# EAGLE design iridia-tam-main-board (EAGLE 6.4)

## Sheet 1 of 5
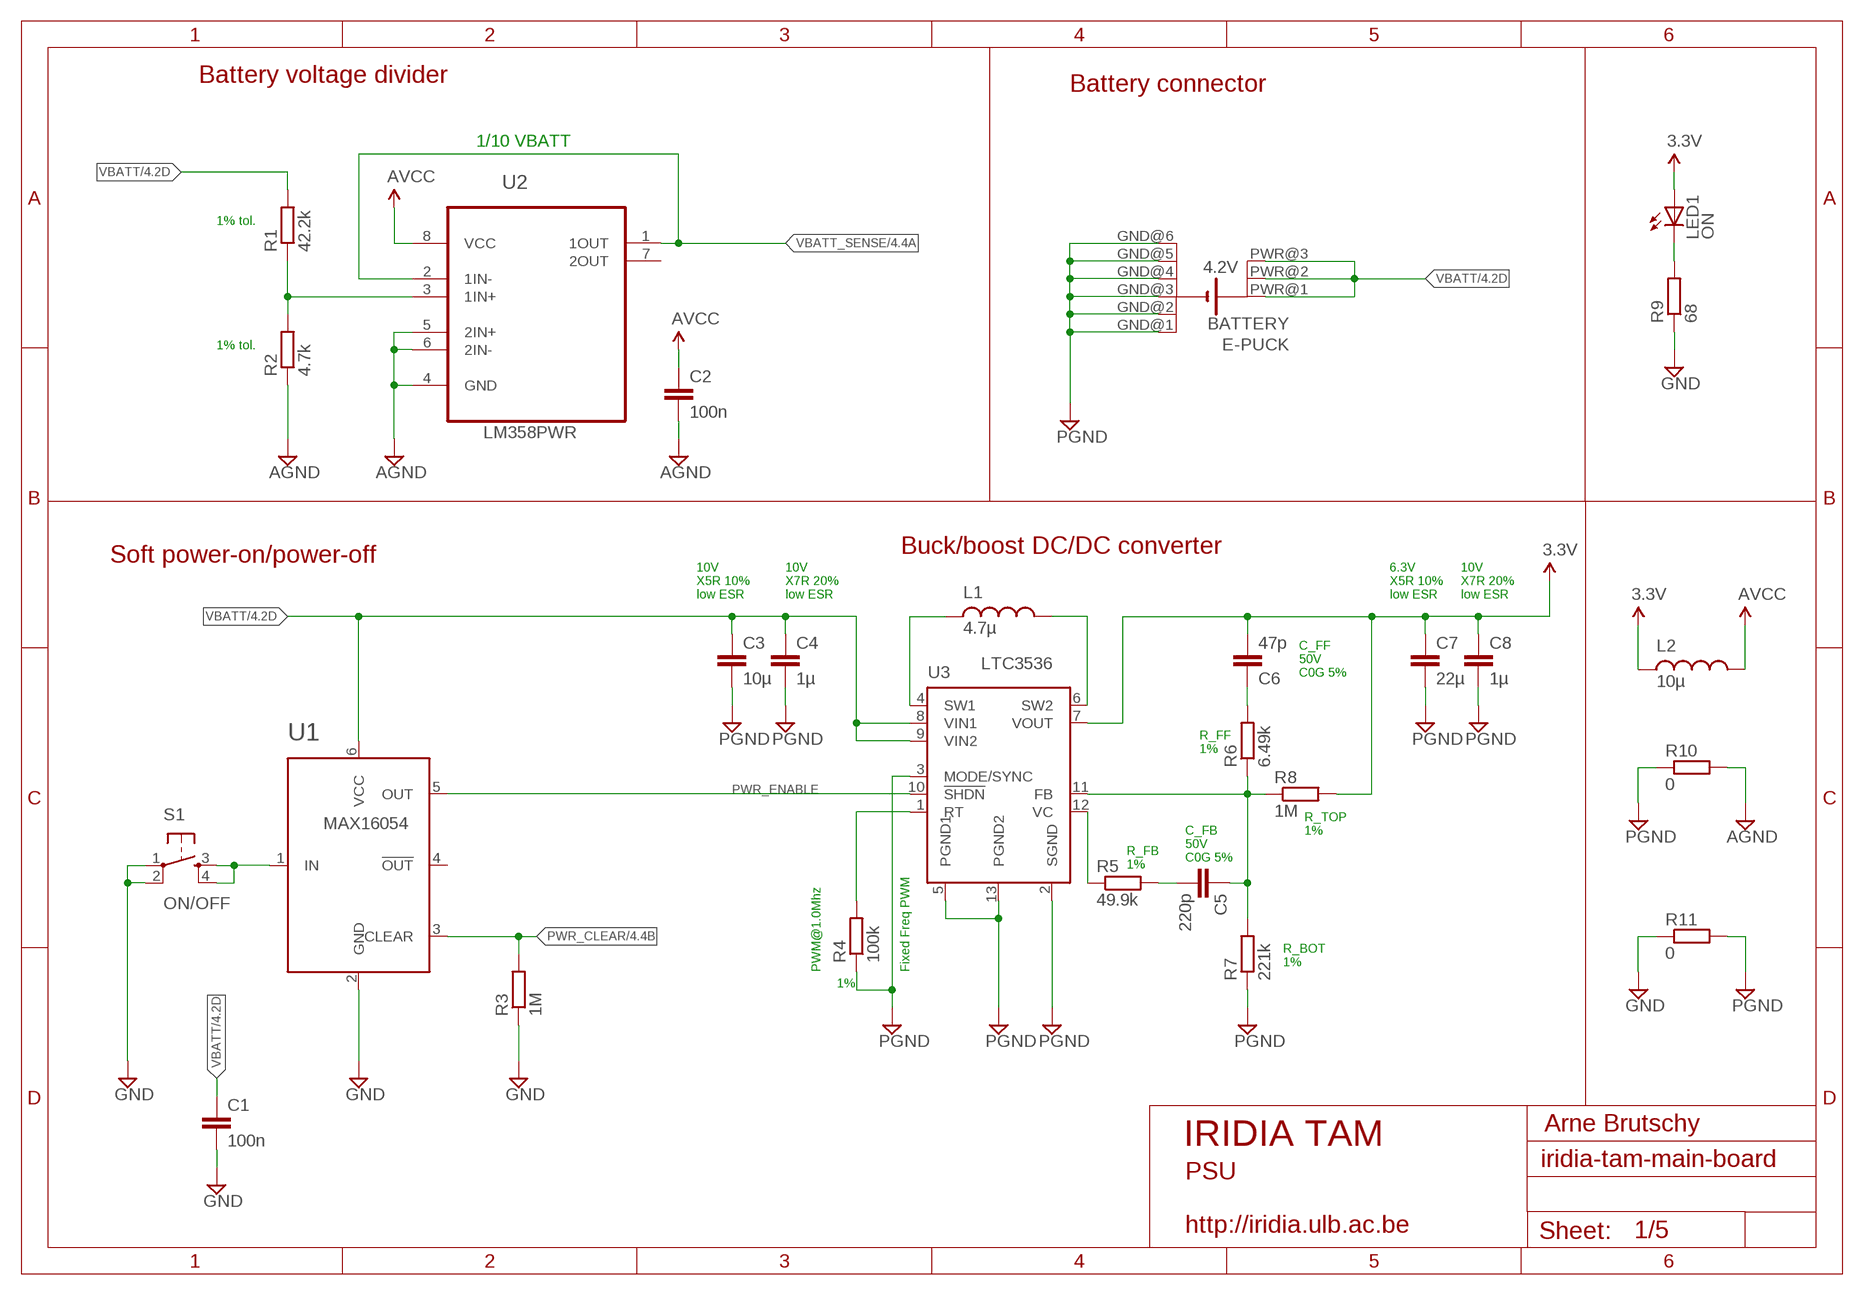
[diagram p0: schematic, sheet 1]

### Parts
C1  100n  C-EUC0603  [C0603]
C2  100n  C-EUC0603  [C0603]
C3  10µ  C-EUC0805  [C0805]
C4  1µ  C-EUC0603  [C0603]
C5  220p  C-EUC0603  [C0603]
C6  47p  C-EUC0603  [C0603]
C7  22µ  C-EUC1206  [C1206]
C8  1µ  C-EUC0603  [C0603]
JP1  EPUCK_BATTERY  [EPUCK_BATTERY]
L1  4.7µ  TDK-INDUCTORS-VLCF  [TDK-VLCF]
L2  10µ  0805-INDUCTORS  [L0805]
LED1  ON  LEDCHIPLED_1206  [CHIPLED_1206]
R1  42.2k  R-EU_R0603  [R0603]
R2  4.7k  R-EU_R0603  [R0603]
R3  1M  R-EU_R0603  [R0603]
R4  100k  R-EU_R0603  [R0603]
R5  49.9k  R-EU_R0603  [R0603]
R6  6.49k  R-EU_R0603  [R0603]
R7  221k  R-EU_R0603  [R0603]
R8  1M  R-EU_R0603  [R0603]
R9  68  R-EU_R0603  [R0603]
R10  0  R-EU_R0603  [R0603]
R11  0  R-EU_R0603  [R0603]
S1  ON/OFF  TAC_SWITCHSMD  [TACTILE_SWITCH_SMD]
U1  MAX16054  [SOT23-6-INV]
U2  LM358PW  [SOP65P640X120-8N]
U3  LTC3536  [MSOP12-EP]

### Nets
AGND [gnd]: C2.2 R2.1 R10.2 U2.4(GND) U2.5(2IN+) U2.6(2IN-) ; also sheet 2,4,5
AVCC [power]: C2.1 L2.2 U2.8(VCC) ; also sheet 2,4,5
GND [gnd]: C1.2 R3.1 R9.1 R11.1 S1.1 S1.2 U1.2(GND) ; also sheet 2,3,4,5
N$4: C6.1 R6.2
N$6 [power]: R4.2 U3.1(RT)
N$11: R1.1 R2.2 U2.3(1IN+)
N$12: LED1.C R9.2
N$15: L1.P$1 U3.4(SW1)
N$16: L1.P$2 U3.6(SW2)
N$18: S1.3 S1.4 U1.1(IN)
N$19: R5.1 U3.12(VC)
N$21: C5.1 R6.1 R7.2 R8.1 U3.11(FB)
N$22: C5.2 R5.2
PGND [gnd]: C3.2 C4.2 C7.2 C8.2 JP1.GND@1(-1) JP1.GND@2(-2) JP1.GND@3(-3) JP1.GND@4(-4) JP1.GND@5(-5) JP1.GND@6(-6) R4.1 R7.1 R10.1 R11.2 U3.2(SGND) U3.3(MODE/SYNC) U3.5(PGND1) U3.13(PGND2) ; also sheet 5
PWR_CLEAR: R3.2 U1.3(CLEAR) ; also sheet 4
PWR_ENABLE: U1.5(OUT) U3.10(!SHDN)
VBATT [power]: C1.1 C3.1 C4.1 JP1.PWR@1(+1) JP1.PWR@2(+2) JP1.PWR@3(+3) R1.2 U1.6(VCC) U3.8(VIN1) U3.9(VIN2) ; also sheet 4,5
VBATT_SENSE: U2.1(1OUT) U2.2(1IN-) ; also sheet 4
VCC [power]: C6.2 C7.1 C8.1 L2.1 LED1.A R8.2 U3.7(VOUT) ; supply symbol labelled 3.3V ; also sheet 2,3,4,5
Unconnected: U1.4(!OUT) U2.7(2OUT)

### Notes on the sheet
- Battery voltage divider
- Battery connector
- 1/10 VBATT
- 1% tol.
- 1% tol.
- LM358PWR
- Buck/boost DC/DC converter
- Soft power-on/power-off
- 10V
  X5R 10%
  low ESR
- 10V
  X7R 20%
  low ESR
- 6.3V
  X5R 10%
  low ESR
- 10V
  X7R 20%
  low ESR
- LTC3536
- C_FF
  50V
  C0G 5%
- U1
- R_FF
  1%
- R_TOP
  1%
- C_FB
  50V
  C0G 5%
- R_FB
  1%
- R_BOT
  1%
- PWM@1.0Mhz | Fixed Freq PWM
- 1%
- Arne Brutschy
- IRIDIA TAM
- PSU
- http://iridia.ulb.ac.be

## Sheet 2 of 5
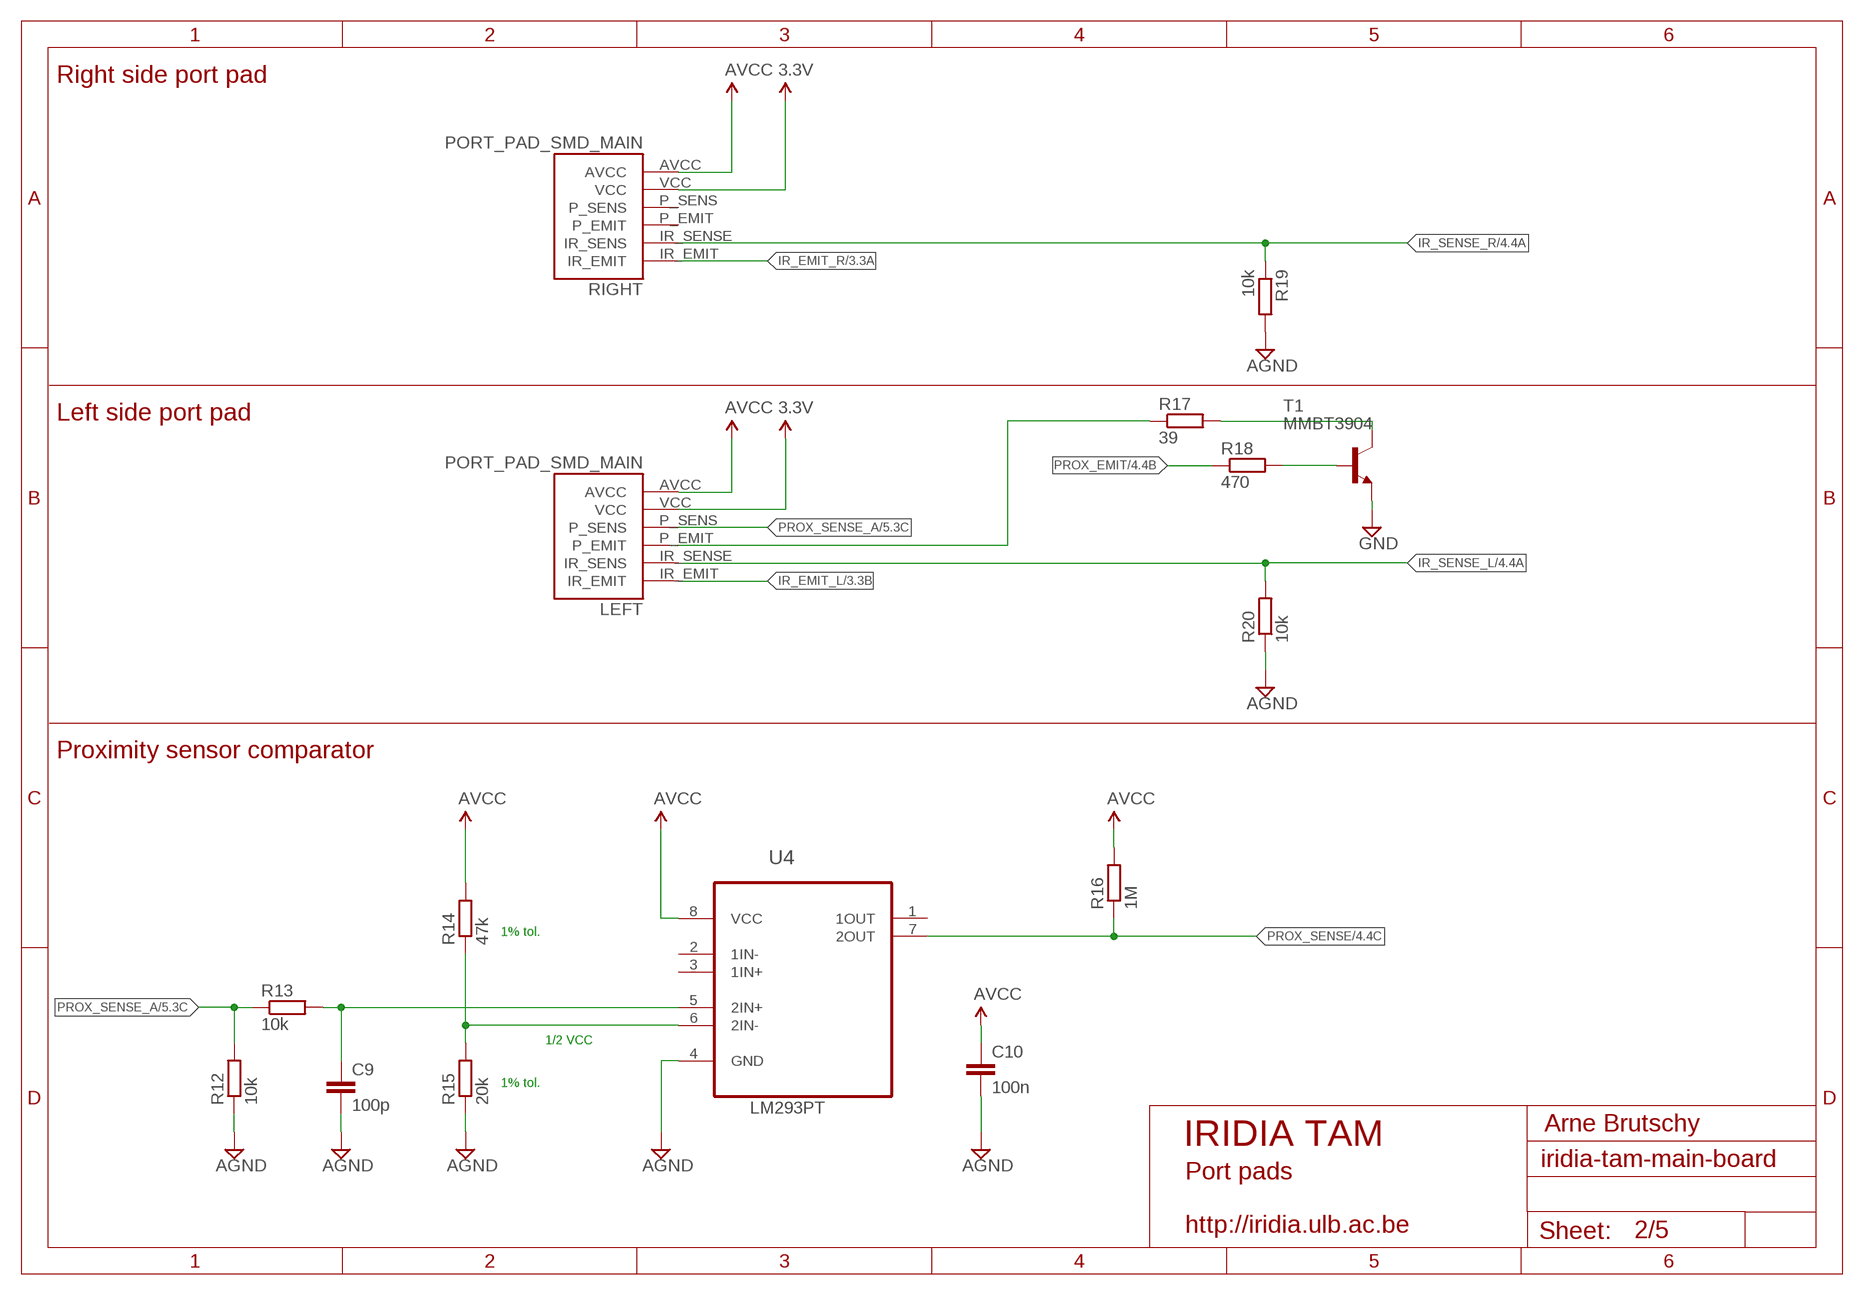
[diagram p1: schematic, sheet 2]

### Parts
C9  100p  C-EUC0603  [C0603]
C10  100n  C-EUC0603  [C0603]
LEFT  PORT_PAD_SMD_MAIN  [PORT_PAD_SMD_MAIN]
R12  10k  R-EU_R0603  [R0603]
R13  10k  R-EU_R0603  [R0603]
R14  47k  R-EU_R0603  [R0603]
R15  20k  R-EU_R0603  [R0603]
R16  1M  R-EU_R0603  [R0603]
R17  39  R-EU_R0603  [R0603]
R18  470  R-EU_R0603  [R0603]
R19  10k  R-EU_R0603  [R0603]
R20  10k  R-EU_R0603  [R0603]
RIGHT  PORT_PAD_SMD_MAIN  [PORT_PAD_SMD_MAIN]
T1  MMBT3904  MMBT3904LT1-NPN-SOT23-BEC  [SOT23-BEC]
U4  LM293PT  [8-TSSOP_4.4MM]

### Nets
AGND [gnd]: C9.2 C10.2 R12.1 R15.1 R19.2 R20.1 U4.4(GND) ; also sheet 1,4,5
AVCC [power]: C10.1 LEFT.AVCC R14.2 R16.2 RIGHT.AVCC U4.8(VCC) ; also sheet 1,4,5
GND [gnd]: T1.E ; also sheet 1,3,4,5
IR_EMIT_L: LEFT.IR_EMIT ; also sheet 3
IR_EMIT_R: RIGHT.IR_EMIT ; also sheet 3
IR_SENSE_L: LEFT.IR_SENSE(IR_SENS) R20.2 ; also sheet 4
IR_SENSE_R: R19.1 RIGHT.IR_SENSE(IR_SENS) ; also sheet 4
N$2: LEFT.P_EMIT R17.1
N$9: R14.1 R15.2 U4.6(2IN-)
N$14: R18.2 T1.B
N$20: R17.2 T1.C
PROX_EMIT: R18.1 ; also sheet 4
PROX_SENSE: R16.1 U4.7(2OUT) ; also sheet 4,5
PROX_SENSE_A: LEFT.P_SENS R12.2 R13.1 ; also sheet 5
PROX_SENSE_S: C9.1 R13.2 U4.5(2IN+) ; also sheet 5
VCC [power]: LEFT.VCC RIGHT.VCC ; supply symbol labelled 3.3V ; also sheet 1,3,4,5
Unconnected: RIGHT.P_EMIT RIGHT.P_SENS U4.1(1OUT) U4.2(1IN-) U4.3(1IN+)

### Notes on the sheet
- Right side port pad
- Left side port pad
- Proximity sensor comparator
- 1% tol.
- 1/2 VCC
- 1% tol.
- LM293PT
- Arne Brutschy
- IRIDIA TAM
- Port pads
- http://iridia.ulb.ac.be

## Sheet 3 of 5
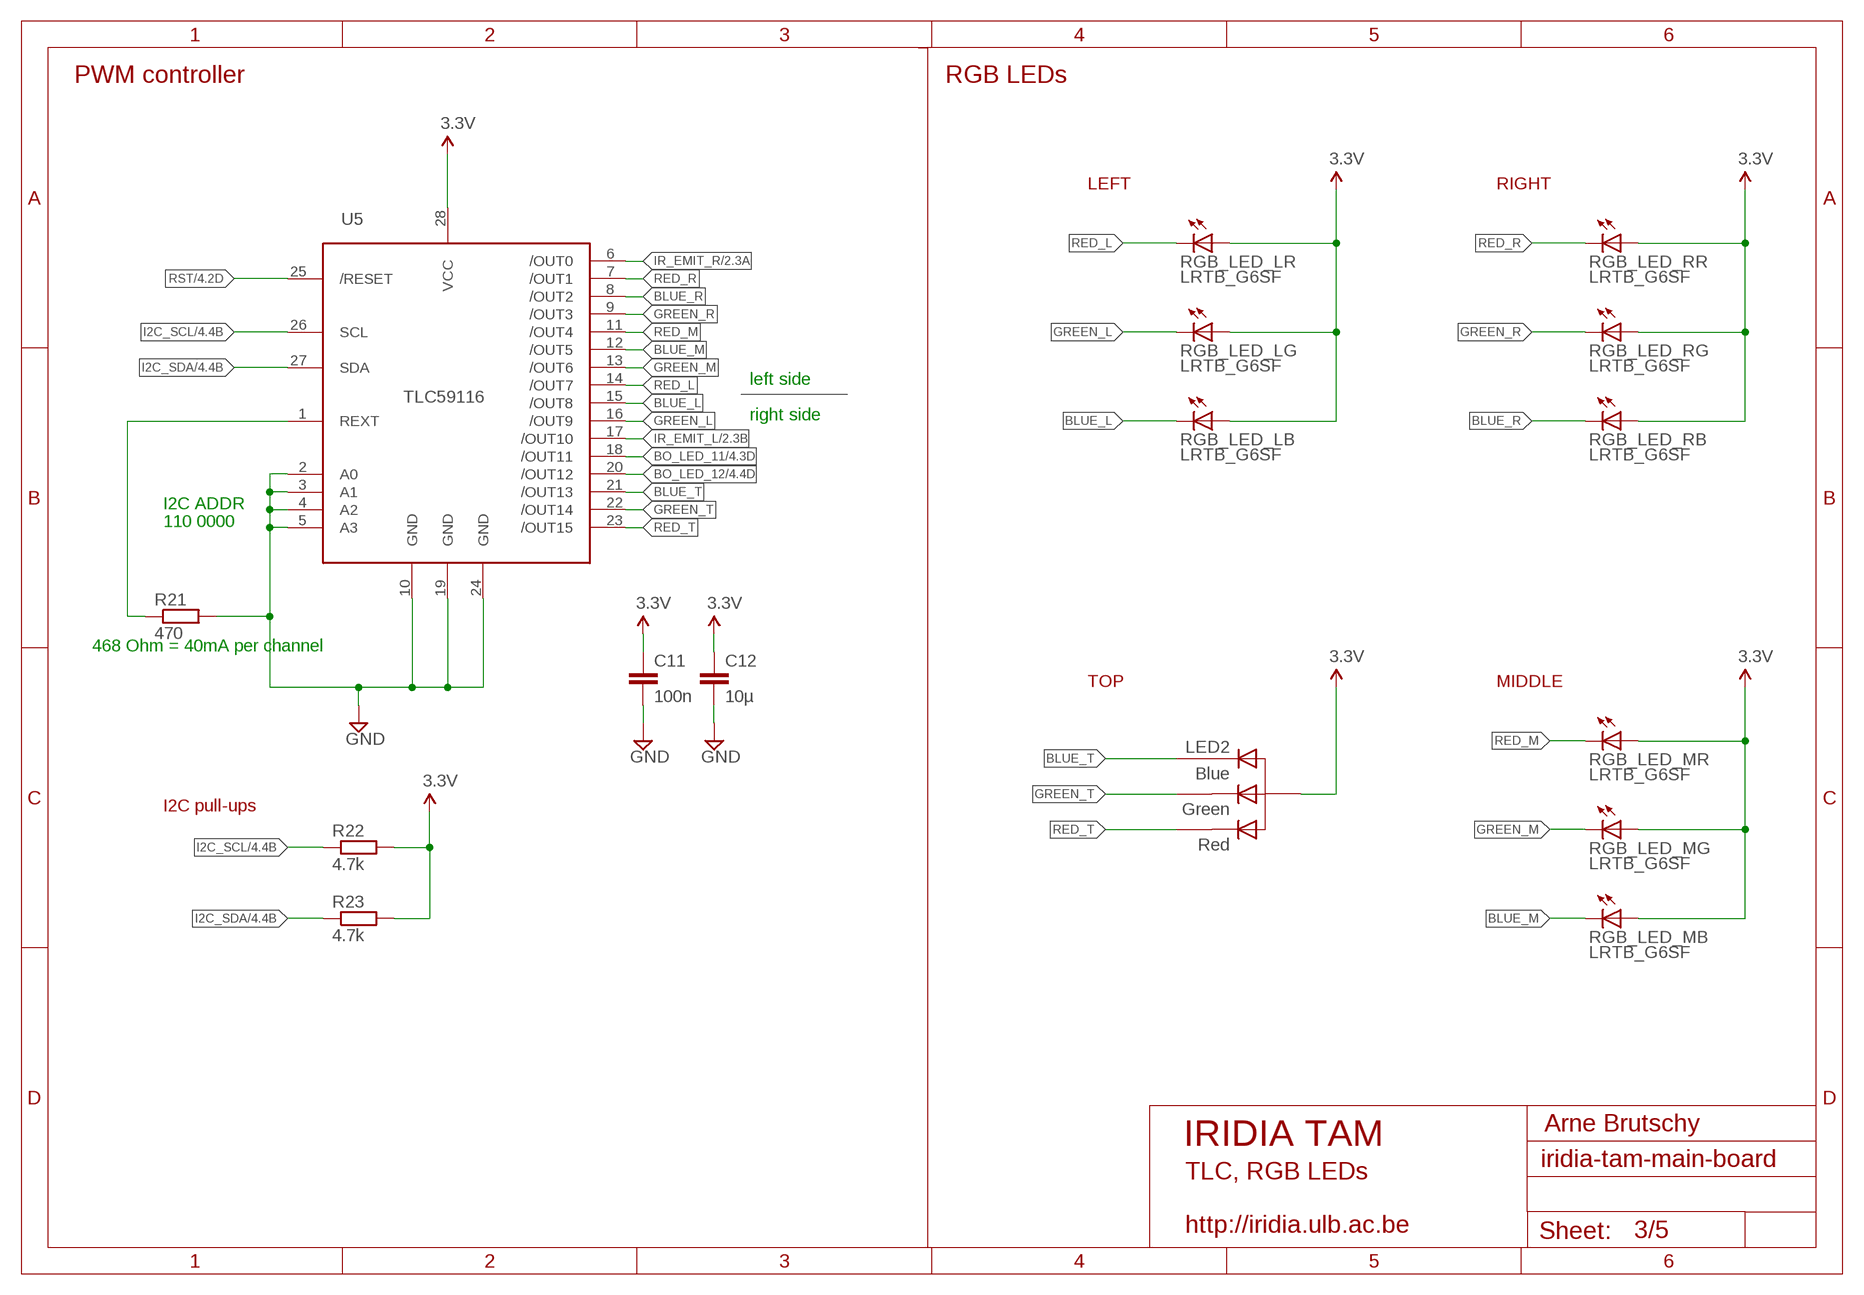
[diagram p2: schematic, sheet 3]

### Parts
C11  100n  C-EUC0603  [C0603]
C12  10µ  C-EUC0805  [C0805]
LED2  RGBLED_CA5MMTROUGHHOLE  [LED5MMRGB]
R21  470  R-EU_R0603  [R0603]
R22  4.7k  R-EU_R0603  [R0603]
R23  4.7k  R-EU_R0603  [R0603]
RGB_LED_L  LRTB_G6SF  MULTILED_LRTB_G6TG  [P-LCC-6_TOPLED]
RGB_LED_M  LRTB_G6SF  MULTILED_LRTB_G6TG  [P-LCC-6_TOPLED]
RGB_LED_R  LRTB_G6SF  MULTILED_LRTB_G6TG  [P-LCC-6_TOPLED]
U5  TLC59116-TSSOP  [TSSOP28]

### Nets
BLUE_L: RGB_LED_L.C3(B:C) U5.15(/OUT8)
BLUE_M: RGB_LED_M.C3(B:C) U5.12(/OUT5)
BLUE_R: RGB_LED_R.C3(B:C) U5.8(/OUT2)
BLUE_T: LED2.4(CB) U5.21(/OUT13)
BO_LED_11: U5.18(/OUT11) ; also sheet 4
BO_LED_12: U5.20(/OUT12) ; also sheet 4
GND [gnd]: C11.2 C12.2 R21.2 U5.2(A0) U5.3(A1) U5.4(A2) U5.5(A3) U5.10(GND) U5.19(GND) U5.24(GND) ; also sheet 1,2,4,5
GREEN_L: RGB_LED_L.C2(G:C) U5.16(/OUT9)
GREEN_M: RGB_LED_M.C2(G:C) U5.13(/OUT6)
GREEN_R: RGB_LED_R.C2(G:C) U5.9(/OUT3)
GREEN_T: LED2.3(CG) U5.22(/OUT14)
I2C_SCL: R22.1 U5.26(SCL) ; also sheet 4
I2C_SDA: R23.1 U5.27(SDA) ; also sheet 4
IR_EMIT_L: U5.17(/OUT10) ; also sheet 2
IR_EMIT_R: U5.6(/OUT0) ; also sheet 2
RED_L: RGB_LED_L.C1(R:C) U5.14(/OUT7)
RED_M: RGB_LED_M.C1(R:C) U5.11(/OUT4)
RED_R: RGB_LED_R.C1(R:C) U5.7(/OUT1)
RED_T: LED2.1(CR) U5.23(/OUT15)
REXT: R21.1 U5.1(REXT)
RST: U5.25(/RESET) ; also sheet 4
VCC [power]: C11.1 C12.1 LED2.2(A) R22.2 R23.2 RGB_LED_L.A1(R:A) RGB_LED_L.A2(G:A) RGB_LED_L.A3(B:A) RGB_LED_M.A1(R:A) RGB_LED_M.A2(G:A) RGB_LED_M.A3(B:A) RGB_LED_R.A1(R:A) RGB_LED_R.A2(G:A) RGB_LED_R.A3(B:A) U5.28(VCC) ; supply symbol labelled 3.3V ; also sheet 1,2,4,5

### Notes on the sheet
- PWM controller | RGB LEDs
- LEFT | RIGHT
- left side
- right side
- I2C ADDR
- 110 0000
- 468 Ohm = 40mA per channel
- TOP | MIDDLE
- I2C pull-ups
- Arne Brutschy
- IRIDIA TAM
- TLC, RGB LEDs
- http://iridia.ulb.ac.be

## Sheet 4 of 5
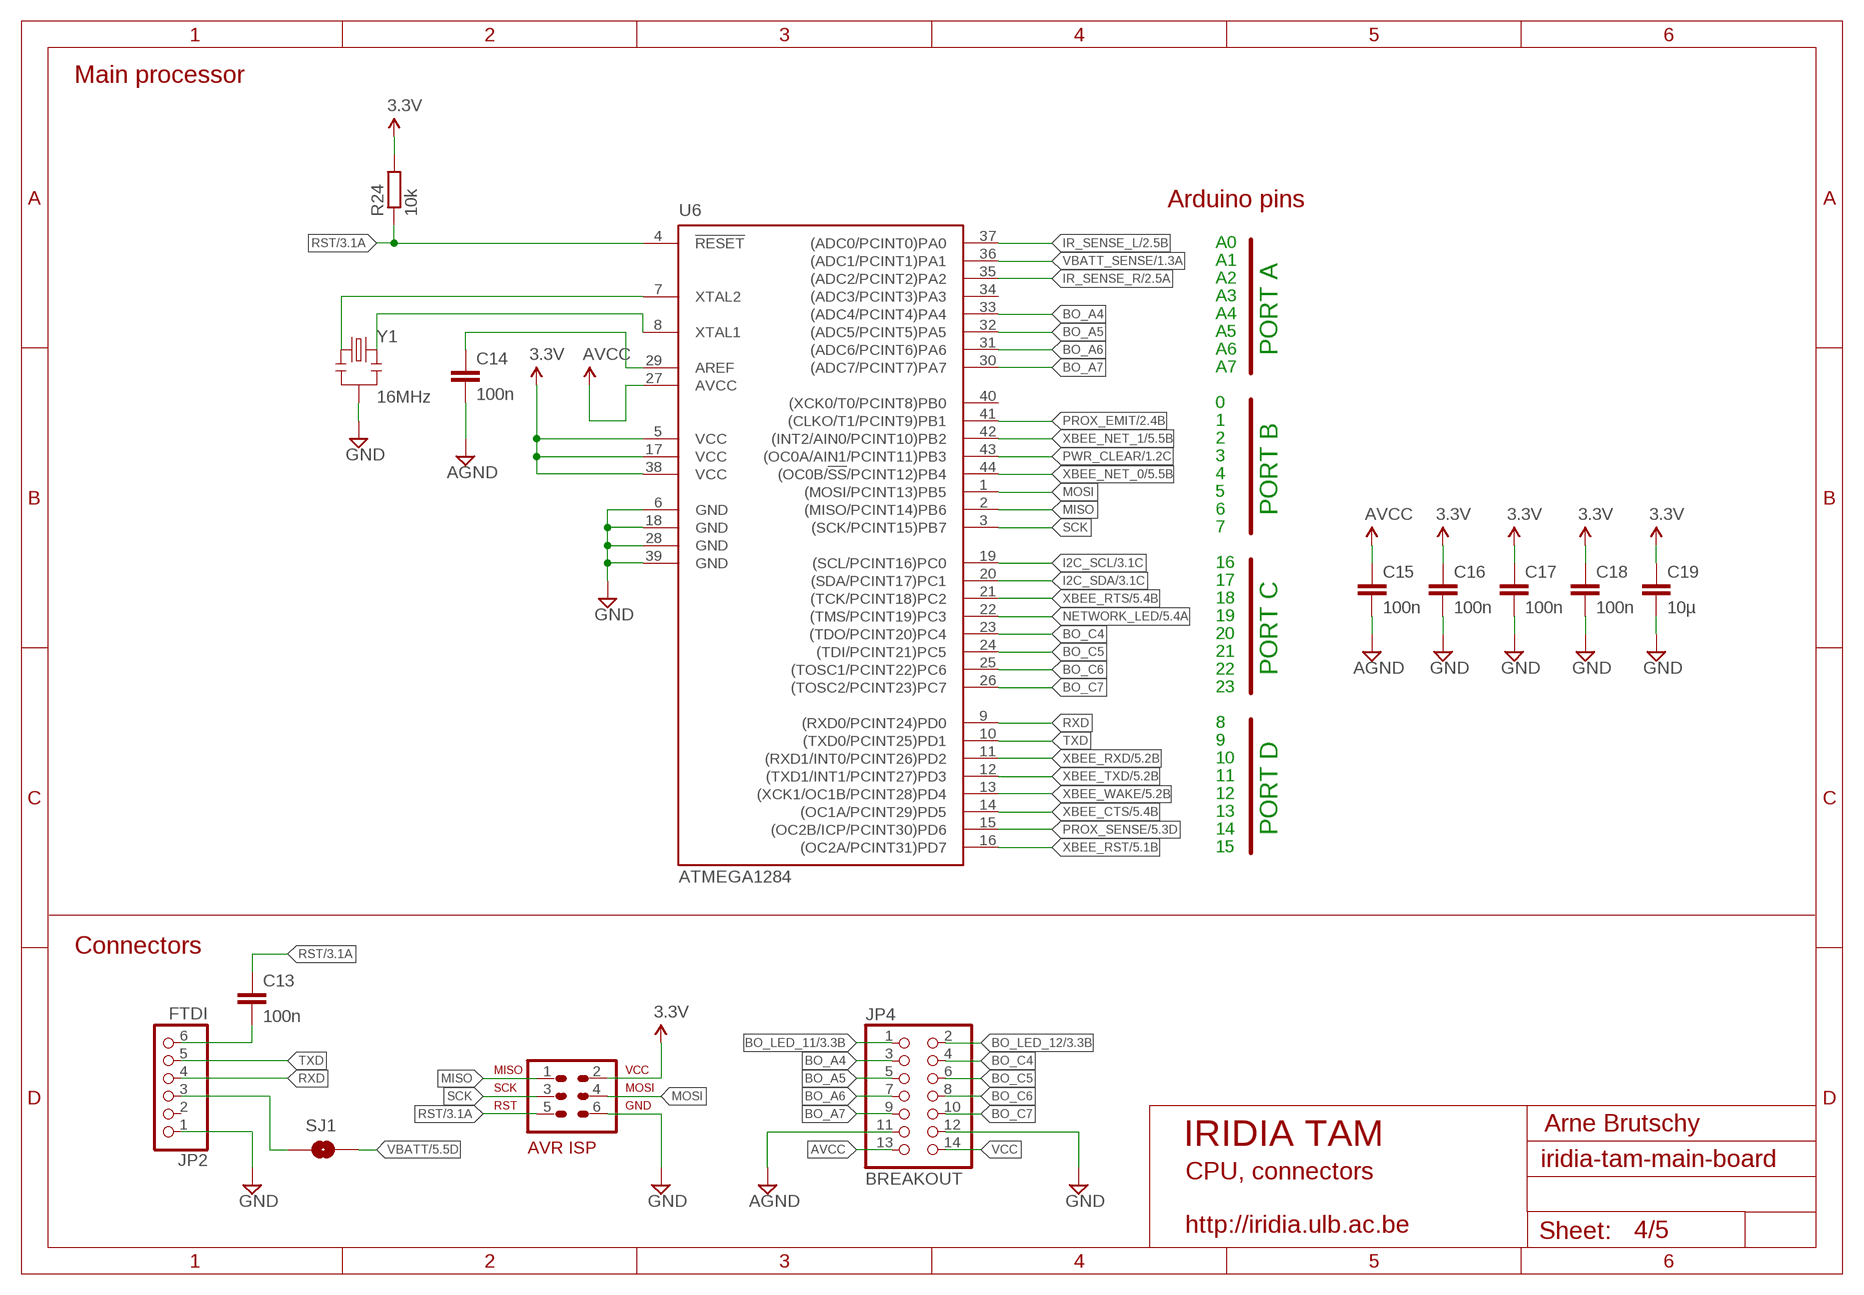
[diagram p3: schematic, sheet 4]

### Parts
C13  100n  C-EUC0603  [C0603]
C14  100n  C-EUC0603  [C0603]
C15  100n  C-EUC0603  [C0603]
C16  100n  C-EUC0603  [C0603]
C17  100n  C-EUC0603  [C0603]
C18  100n  C-EUC0603  [C0603]
C19  10µ  C-EUC0805  [C0805]
JP2  FTDI  PINHD-1X6_2.54-SMD-90°  [1X06SMD/90]
JP3  ISP  AVR-ISP-6VERT  [AVR-ISP-6]
JP4  BREAKOUT  PINHD-2X07_2.54-SMD  [2X07SMD]
R24  10k  R-EU_R0603  [R0603]
SJ1  SOLDERJUMPERTRACE  [SJ_2S-TRACE]
U6  ATMEGA1284  ATMEGA164/324/644/1284-AU  [TQFP44]
Y1  16MHz  RESONATOR16MHZ  [RESONATOR-SMD]

### Nets
AGND [gnd]: C14.2 C15.2 JP4.11 ; also sheet 1,2,5
AREF: C14.1 U6.29(AREF)
AVCC [power]: C15.1 JP4.13 U6.27(AVCC) ; also sheet 1,2,5
BO_A4: JP4.3 U6.33((ADC4/PCINT4)PA4)
BO_A5: JP4.5 U6.32((ADC5/PCINT5)PA5)
BO_A6: JP4.7 U6.31((ADC6/PCINT6)PA6)
BO_A7: JP4.9 U6.30((ADC7/PCINT7)PA7)
BO_C4: JP4.4 U6.23((TDO/PCINT20)PC4)
BO_C5: JP4.6 U6.24((TDI/PCINT21)PC5)
BO_C6: JP4.8 U6.25((TOSC1/PCINT22)PC6)
BO_C7: JP4.10 U6.26((TOSC2/PCINT23)PC7)
BO_LED_11: JP4.1 ; also sheet 3
BO_LED_12: JP4.2 ; also sheet 3
FTDI_RST1: C13.2 JP2.6
GND [gnd]: C16.2 C17.2 C18.2 C19.2 JP2.1 JP3.6 JP4.12 U6.6(GND) U6.18(GND) U6.28(GND) U6.39(GND) Y1.2 ; also sheet 1,2,3,5
I2C_SCL: U6.19((SCL/PCINT16)PC0) ; also sheet 3
I2C_SDA: U6.20((SDA/PCINT17)PC1) ; also sheet 3
IR_SENSE_L: U6.37((ADC0/PCINT0)PA0) ; also sheet 2
IR_SENSE_R: U6.35((ADC2/PCINT2)PA2) ; also sheet 2
MISO: JP3.1 U6.2((MISO/PCINT14)PB6)
MOSI: JP3.4 U6.1((MOSI/PCINT13)PB5)
N$7 [power]: JP2.3 SJ1.1
NETWORK_LED: U6.22((TMS/PCINT19)PC3) ; also sheet 5
PROX_EMIT: U6.41((CLKO/T1/PCINT9)PB1) ; also sheet 2
PROX_SENSE: U6.15((OC2B/ICP/PCINT30)PD6) ; also sheet 2,5
PWR_CLEAR: U6.43((OC0A/AIN1/PCINT11)PB3) ; also sheet 1
RST: C13.1 JP3.5 R24.1 U6.4(!RESET) ; also sheet 3
RXD: JP2.4 U6.9((RXD0/PCINT24)PD0)
SCK: JP3.3 U6.3((SCK/PCINT15)PB7)
TXD: JP2.5 U6.10((TXD0/PCINT25)PD1)
VBATT [power]: SJ1.2 ; also sheet 1,5
VBATT_SENSE: U6.36((ADC1/PCINT1)PA1) ; also sheet 1
VCC [power]: C16.1 C17.1 C18.1 C19.1 JP3.2 JP4.14 R24.2 U6.5(VCC) U6.17(VCC) U6.38(VCC) ; supply symbol labelled 3.3V ; also sheet 1,2,3,5
XBEE_CTS: U6.14((OC1A/PCINT29)PD5) ; also sheet 5
XBEE_NET_0: U6.44((OC0B/!SS!/PCINT12)PB4) ; also sheet 5
XBEE_NET_1: U6.42((INT2/AIN0/PCINT10)PB2) ; also sheet 5
XBEE_RST: U6.16((OC2A/PCINT31)PD7) ; also sheet 5
XBEE_RTS: U6.21((TCK/PCINT18)PC2) ; also sheet 5
XBEE_RXD: U6.11((RXD1/INT0/PCINT26)PD2) ; also sheet 5
XBEE_TXD: U6.12((TXD1/INT1/PCINT27)PD3) ; also sheet 5
XBEE_WAKE: U6.13((XCK1/OC1B/PCINT28)PD4) ; also sheet 5
Y1_1: U6.7(XTAL2) Y1.1
Y1_2: U6.8(XTAL1) Y1.3
Unconnected: JP2.2 U6.34((ADC3/PCINT3)PA3) U6.40((XCK0/T0/PCINT8)PB0)

### Notes on the sheet
- Main processor
- Arduino pins
- A0
- A1
- A2
- A3
- A4
- A5
- A6 | PORT A
- A7
- 0
- 1
- 2
- 3
- 4
- 5
- 6 | PORT B
- 7
- 16
- 17
- 18
- 19
- 20
- 21
- 22 | PORT C
- 23
- 8
- 9
- 10
- 11
- 12
- 13
- 14 | PORT D
- 15
- Connectors
- Arne Brutschy
- IRIDIA TAM
- CPU, connectors
- http://iridia.ulb.ac.be

## Sheet 5 of 5
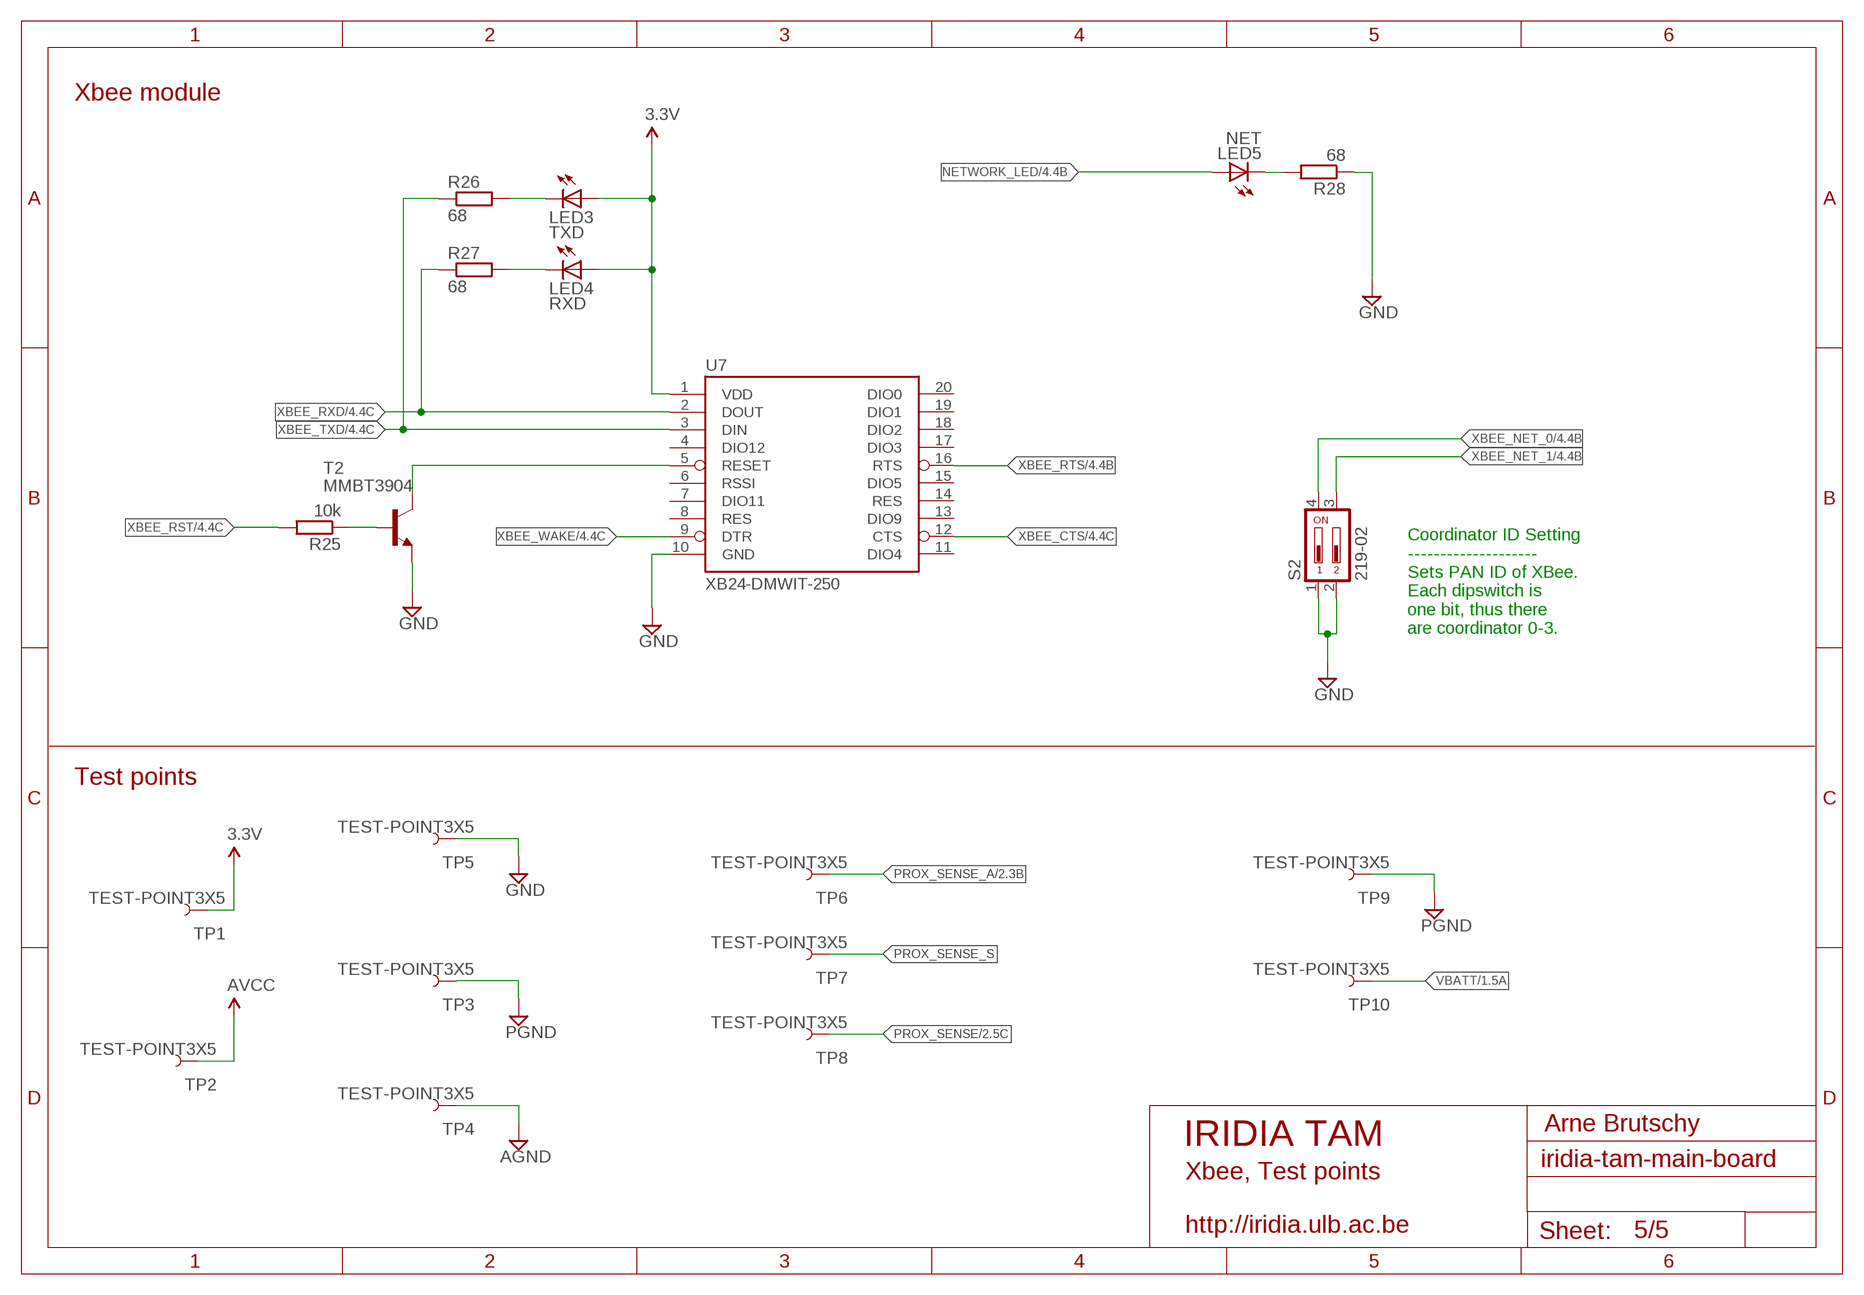
[diagram p4: schematic, sheet 5]

### Parts
LED3  TXD  LEDCHIPLED_0805  [CHIPLED_0805]
LED4  RXD  LEDCHIPLED_0805  [CHIPLED_0805]
LED5  NET  LEDCHIPLED_0805  [CHIPLED_0805]
R25  10k  R-EU_R0603  [R0603]
R26  68  R-EU_R0603  [R0603]
R27  68  R-EU_R0603  [R0603]
R28  68  R-EU_R0603  [R0603]
S2  219-02  [CTS-219-02]
T2  MMBT3904  MMBT3904LT1-NPN-SOT23-BEC  [SOT23-BEC]
TP1  TEST-POINT3X5  [PAD.03X.05]
TP2  TEST-POINT3X5  [PAD.03X.05]
TP3  TEST-POINT3X5  [PAD.03X.05]
TP4  TEST-POINT3X5  [PAD.03X.05]
TP5  TEST-POINT3X5  [PAD.03X.05]
TP6  TEST-POINT3X5  [PAD.03X.05]
TP7  TEST-POINT3X5  [PAD.03X.05]
TP8  TEST-POINT3X5  [PAD.03X.05]
TP9  TEST-POINT3X5  [PAD.03X.05]
TP10  TEST-POINT3X5  [PAD.03X.05]
U7  XB24-DMWIT-250  XBEE-1B3  [XBEE-SMD]

### Nets
AGND [gnd]: TP4.P$1 ; also sheet 1,2,4
AVCC [power]: TP2.P$1 ; also sheet 1,2,4
GND [gnd]: R28.1 S2.1 S2.2 T2.E TP5.P$1 U7.10(GND) ; also sheet 1,2,3,4
N$1: LED4.C R27.2
N$5: R25.1 T2.B
N$8: LED3.C R26.2
N$10: T2.C U7.5(RESET)
N$13: LED5.C R28.2
NETWORK_LED: LED5.A ; also sheet 4
PGND [gnd]: TP3.P$1 TP9.P$1 ; also sheet 1
PROX_SENSE: TP8.P$1 ; also sheet 2,4
PROX_SENSE_A: TP6.P$1 ; also sheet 2
PROX_SENSE_S: TP7.P$1 ; also sheet 2
VBATT [power]: TP10.P$1 ; also sheet 1,4
VCC [power]: LED3.A LED4.A TP1.P$1 U7.1(VDD) ; supply symbol labelled 3.3V ; also sheet 1,2,3,4
XBEE_CTS: U7.12(CTS) ; also sheet 4
XBEE_NET_0: S2.4 ; also sheet 4
XBEE_NET_1: S2.3 ; also sheet 4
XBEE_RST: R25.2 ; also sheet 4
XBEE_RTS: U7.16(RTS) ; also sheet 4
XBEE_RXD: R27.1 U7.2(DOUT) ; also sheet 4
XBEE_TXD: R26.1 U7.3(DIN) ; also sheet 4
XBEE_WAKE: U7.9(DTR) ; also sheet 4
Unconnected: U7.4(DIO12) U7.6(RSSI) U7.7(DIO11) U7.8(RES) U7.11(DIO4) U7.13(DIO9) U7.14(RES) U7.15(DIO5) U7.17(DIO3) U7.18(DIO2) U7.19(DIO1) U7.20(DIO0)

### Notes on the sheet
- Xbee module
- Coordinator ID Setting
  --------------------
  Sets PAN ID of XBee. 
  Each dipswitch is
  one bit, thus there
  are coordinator 0-3.
- Test points
- Arne Brutschy
- IRIDIA TAM
- Xbee, Test points
- http://iridia.ulb.ac.be

## Library data of the parts
C1-C19 = resistor:C-EU: CAPACITOR, European symbol
JP1 = iridia:EPUCK_BATTERY: E-Puck Battery Holder As on epuck charger
JP2 = iridia:PINHD-1X6: PIN HEADER
JP3 = iridia:AVR-ISP-6: AVR ISP-6 Serial Programming Header
JP4 = iridia:PINHD-2X07: PIN HEADER
L1 = iridia:TDK-INDUCTORS: SMD Inductors(Coils) For Power Line(Wound, Magnetic Shielded) VLF Series VLF4012S FEATURES • Miniature size Mount area: 3.6× 3.8mm Height: 1.2mm max. • Generic use for portable DC to DC converter line. • High magnetic shield construction should actualize high resolution for EMC protection. • Available for automatic mounting in tape and real package. • The products do not contain lead and support lead-free soldering.
L2 = iridia:0805-INDUCTORS
LED1 LED3-LED5 = led:LED: LED OSRAM: - CHIPLED LG R971, LG N971, LY N971, LG Q971, LY Q971, LO R971, LY R971 LH N974, LH R974 LS Q976, LO Q976, LY Q976 LO Q996 - Hyper CHIPLED LW Q18S LB Q993, LB Q99A, LB R99A - SideLED LS A670, LO A670, LY A670, LG A670, LP A670 LB A673, LV A673, LT A673, LW A673 LH A674 LY A675 LS A676, LA A676, LO A676, LY A676, LW A676 LS A679, LY A679, LG A679 - Hyper Micro SIDELED® LS Y876, LA Y876, LO Y876, LY Y876 LT Y87S - SmartLED LW L88C, LW L88S LB L89C, LB L89S, LG L890 LS L89K, LO L89K, LY L89K LS L896, LA L896, LO L896, LY L896 - TOPLED LS T670, LO T670, LY T670, LG T670, LP T670 LSG T670, LSP T670, LSY T670, LOP T670, LYG T670 LG T671, LOG T671, LSG T671 LB T673, LV T673, LT T673, LW T673 LH T674 LS T676, LA T676, LO T676, LY T676, LB T676, LH T676, LSB T676, LW T676 LB T67C, LV T67C, LT T67C, LS T67K, LO T67K, LY T67K, LW E67C LS E67B, LA E67B, LO E67B, LY E67B, LB E67C, LV E67C, LT E67C LW T67C LS T679, LY T679, LG T679 LS T770, LO T770, LY T770, LG T770, LP T770 LB T773, LV T773, LT T773, LW T773 LH T774 LS E675, LA E675, LY E675, LS T675 LS T776, LA T776, LO T776, LY T776, LB T776 LHGB T686 LT T68C, LB T68C - Hyper Mini TOPLED® LB M676 - Mini TOPLED Santana® LG M470 LS M47K, LO M47K, LY M47K Source: http://www.osram.convergy.de LUXEON: - LUMILED® LXK2-PW12-R00, LXK2-PW12-S00, LXK2-PW14-U00, LXK2-PW14-V00 LXK2-PM12-R00, LXK2-PM12-S00, LXK2-PM14-U00 LXK2-PE12-Q00, LXK2-PE12-R00, LXK2-PE12-S00, LXK2-PE14-T00, LXK2-PE14-U00 LXK2-PB12-K00, LXK2-PB12-L00, LXK2-PB12-M00, LXK2-PB14-N00, LXK2-PB14-P00, LXK2-PB14-Q00 LXK2-PR12-L00, LXK2-PR12-M00, LXK2-PR14-Q00, LXK2-PR14-R00 LXK2-PD12-Q00, LXK2-PD12-R00, LXK2-PD12-S00 LXK2-PH12-R00, LXK2-PH12-S00 LXK2-PL12-P00, LXK2-PL12-Q00, LXK2-PL12-R00 Source: www.luxeon.com KINGBRIGHT: KA-3528ASYC Source: www.kingbright.com
LED2 = iridia:RGBLED_CA: RGB LED, common-anode 5MM Staggered pins YSL-R596AR3G4B5C-C10 https://www.sparkfun.com/products/10821 BL-L515RGBW-CA http://www.adafruit.com/products/159
LEFT RIGHT = iridia:PORT_PAD_SMD_MAIN: Connector pad for soldering side boards on main board of IRIDIA TAM
R1-R28 = resistor:R-EU_: RESISTOR, European symbol
RGB_LED_L RGB_LED_M RGB_LED_R = led:MULTILED_LRTB_G6TG: 6-lead MULTILED® Enhanced optical Power LED (ThinFilm® / ThinGaN®) Source. OSRAM - LRTB_G6TG.pdf
S1 = iridia:TAC_SWITCH: Momentary Switch Button commonly used for reset or general input. Spark Fun Electronics SKU : COM-00097 SMT- SWCH-08247; PROD_ID: SWCH-08247
S2 = switch-dil:219-02*: Surface Mount DIP Switch Series 219 SMT CTS Electronic Components Sourc: www.ctscorp.com; OC_FARNELL: unknown; OC_NEWARK: unknown
SJ1 = iridia:SOLDERJUMPER: Solder Jumper Standard SMD solder jumper. Used to automate production. Two varients : Normally Open and Normally Closed are the same, but have different paste layers. NC will have a large amount of paste and should jumper during reflow.
T1 T2 = transistor:*-NPN-: NPN Transistror BF959 corrected 2008.03.06
TP1-TP10 = iridia:TEST-POINT: Bare copper test points for troubleshooting or ICT
U1 = iridia:MAX16054: MAX16054 On/Off Controller with Debounce and ±15kV ESD Protection
U2 = iridia:LM358PW: DUAL OPERATIONAL AMPLIFIERS; MPN: LM358PW; OC_FARNELL: 8389250; OC_NEWARK: 38K3721; PACKAGE: TSSOP-8; SUPPLIER: Texas Instruments
U3 = iridia:LTC3536: LTC3536 1A Low Noise, Buck-Boost DC/DC Converter
U4 = iridia:LM293PT: DUAL OPERATIONAL COMPARATORS LM2903PT LM293PT
U5 = iridia:TLC59116-TSSOP
U6 = iridia:ATMEGA164/324/644/1284-AU
U7 = iridia:XBEE-1: Xbee module footprints SMT header is CONN-09042.; PROD_ID: CONN-09042
Y1 = iridia:RESONATOR: Resonator Digikey: CSTCE16M0V53-R0 Description CER RESONATOR 16.0MHZ SMD; PROD_ID: XTAL-08900

## Net classes
1 power: width 0.381 mm, clearance 0.254 mm
2 gnd: width 0.305 mm, drill 0.152 mm, clearance 0.152 mm

## Board
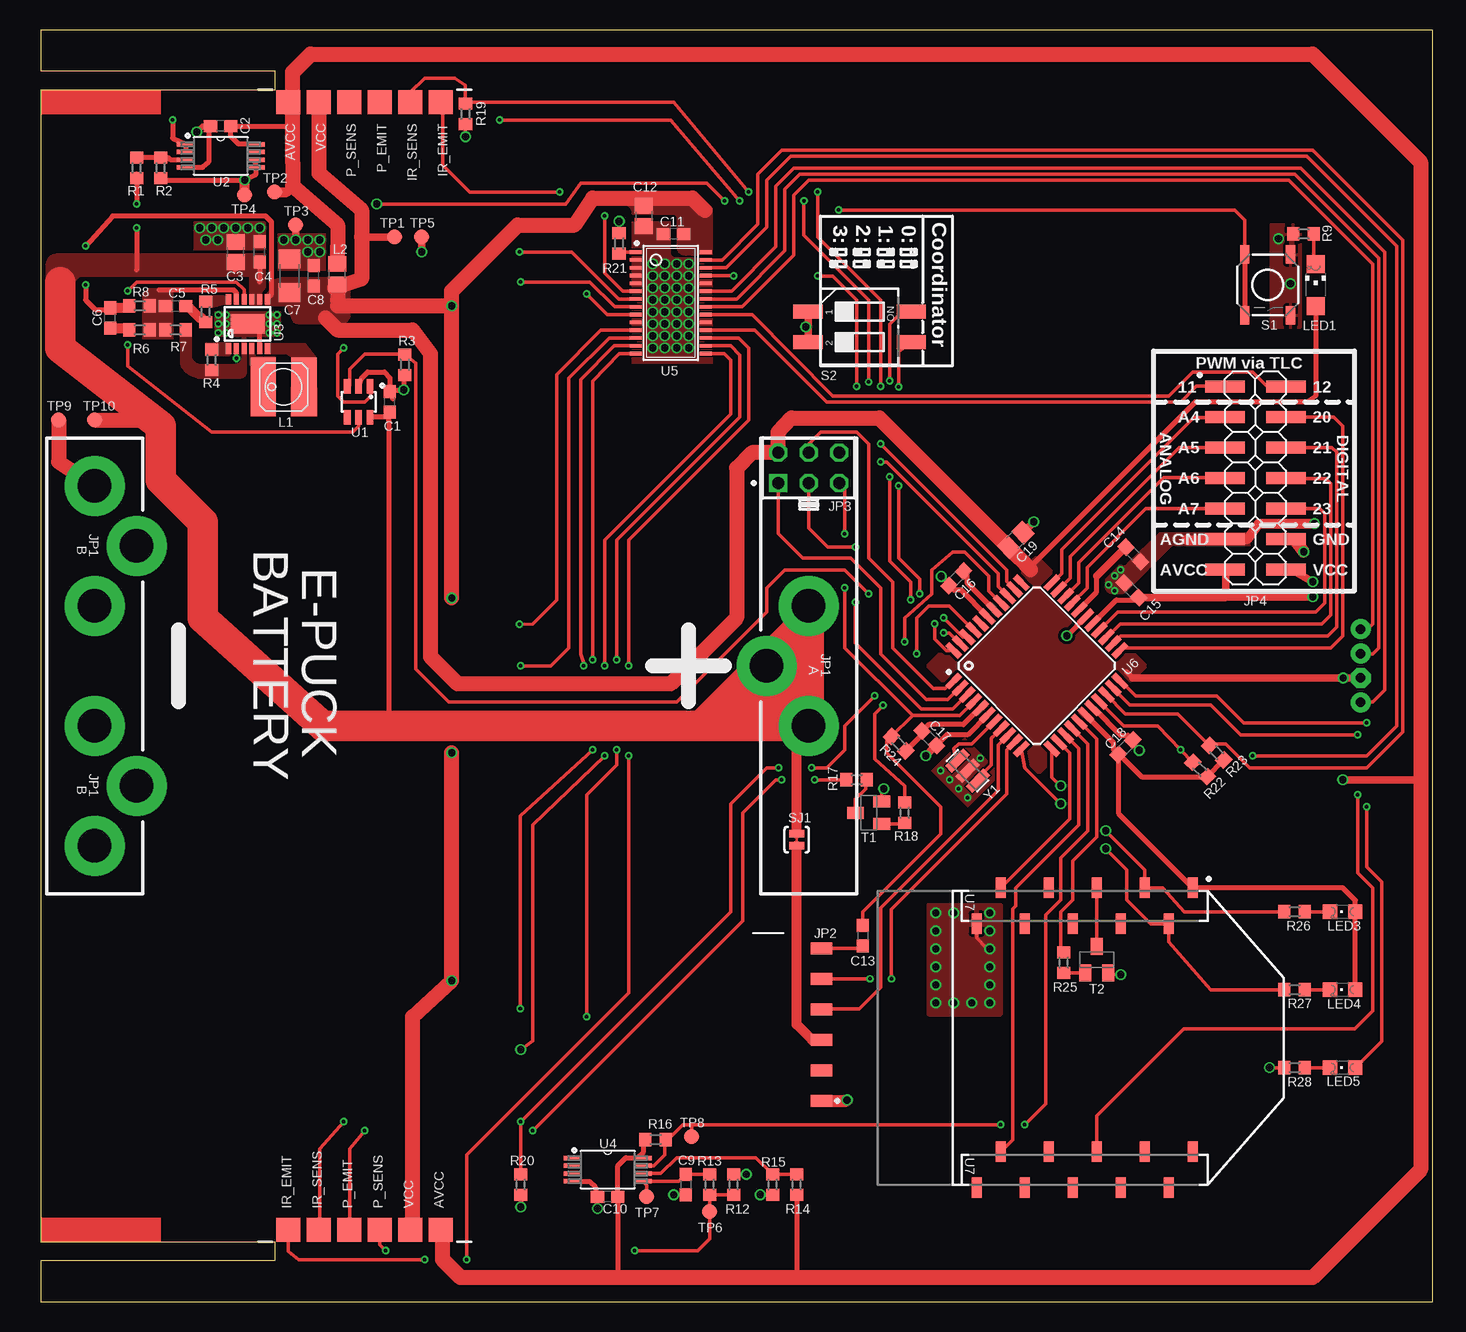
[diagram p5: board, top side]
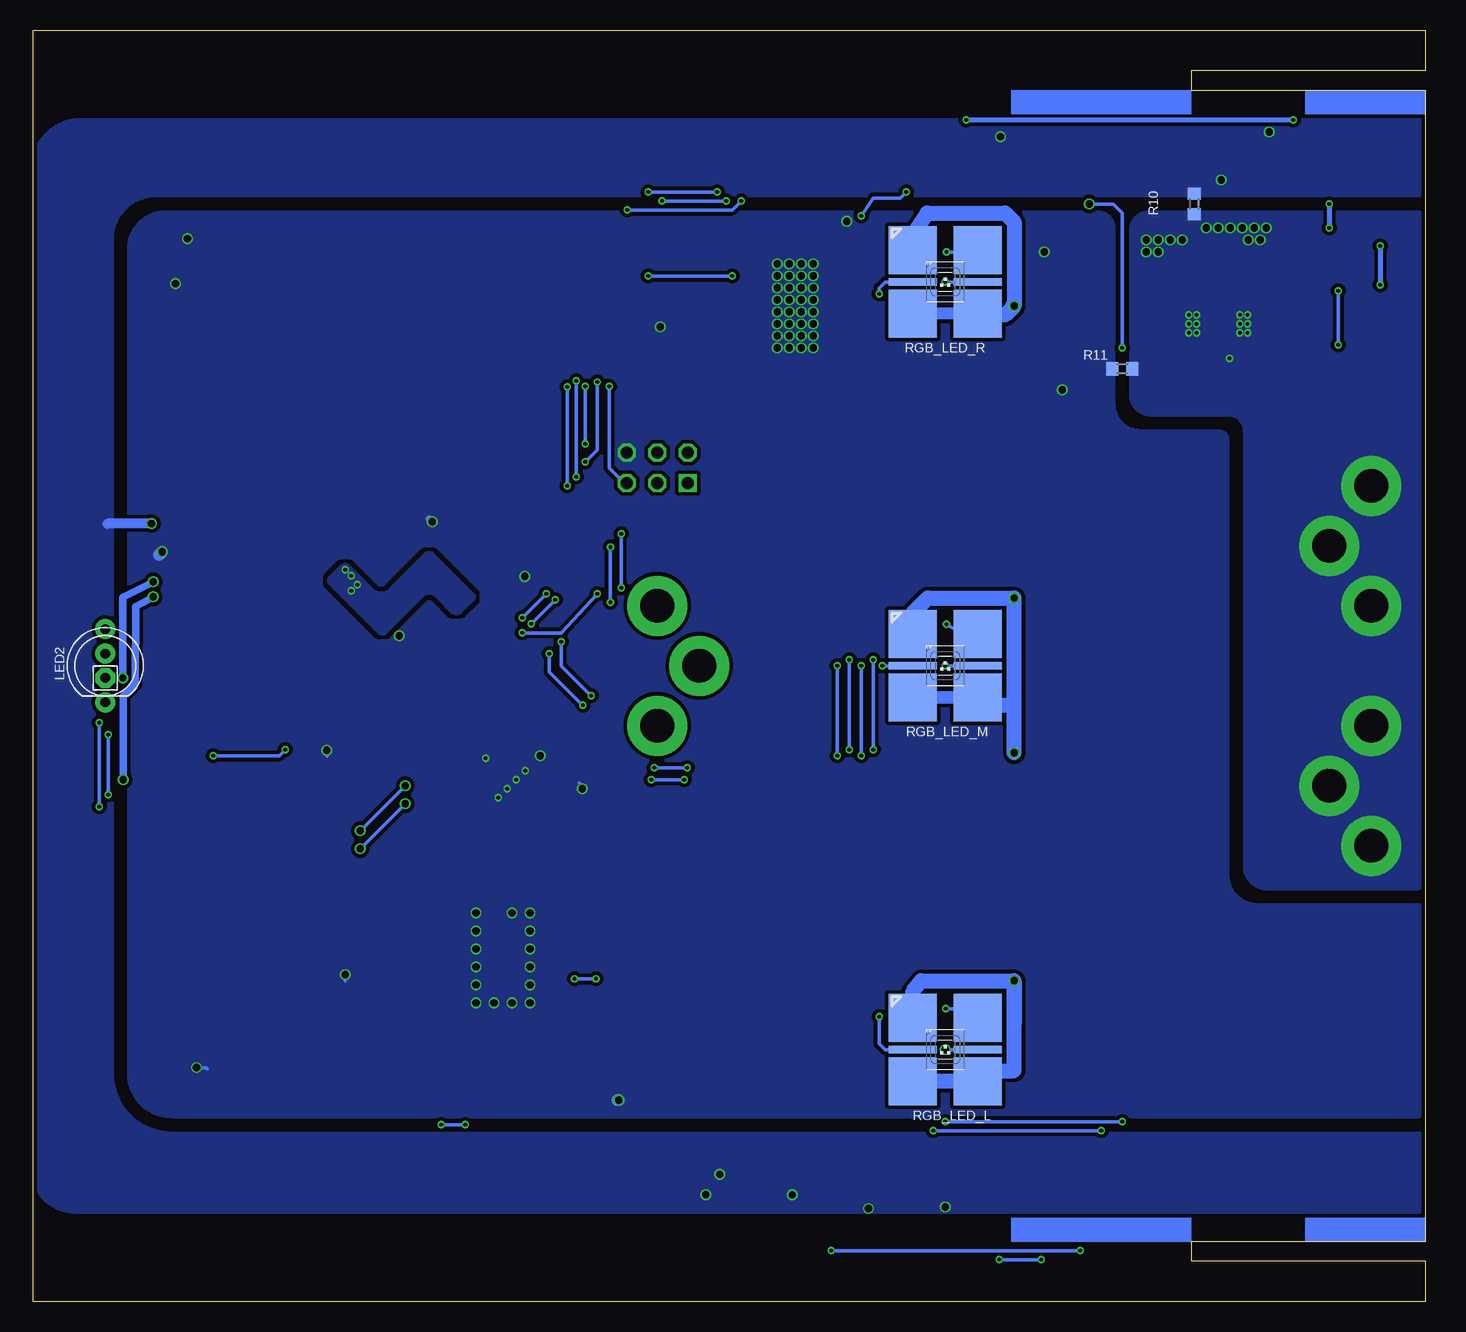
[diagram p6: board, bottom side, seen from below]

Size 116 x 106 mm. Coordinates in mm from the lower left corner, seen from the top.
Outline: 0,0 116,0 116,106 0,106 0,102.6 19.5,102.6 19.5,101 0,101 0,5 19.5,5 19.5,3.4 0,3.4 0,0
Copper layers (1*16): Top 0.035mm / dielectric 1.5mm / Bottom 0.035mm
Design rules "myropcb": minimum track width 4mil, minimum drill 6mil, track to track 4mil, track to pad 4mil, pad to pad 4mil, via to via 4mil, smd to smd 0mil, copper to edge 10mil, drill to drill 10mil, minimum pad ring 10mil, minimum via ring 6mil, stop-mask expansion 2mil, vias tented up to drill 100mil, thermal gap 10mil
tKeepout: area 111,0 to 116,106; area 9,34 to 60,72; area 0,101 to 111,106; area 0,0 to 111,5

### Footprints (pad centres in the part's own frame; a part is rotated, then mirrored left to right if it is on the bottom)
C0603 = smd 1.1 x 1: 1 -0.85,0; 2 0.85,0
C0805 = smd 1.3 x 1.5: 1 -0.85,0; 2 0.85,0
C1206 = smd 1.6 x 1.8: 1 -1.4,0; 2 1.4,0
EPUCK_BATTERY = drill 2.8 pad 5: GND@1 29.5,15; GND@2 26,10; GND@3 29.5,5; GND@4 29.5,-5; GND@5 26,-10; GND@6 29.5,-15; PWR@1 -30,5; PWR@2 -26.5,0; PWR@3 -30,-5
1X06SMD/90 = smd 1.016 x 1.778: 1 -1.27,-5.08; 2 1.27,-5.08; 3 3.81,-5.08; 4 6.35,-5.08; 5 8.89,-5.08; 6 11.43,-5.08
AVR-ISP-6 = drill 1.016 square: 1 -2.54,-1.27 | drill 1.016 octagon: 2 -2.54,1.27; 3 0,-1.27; 4 0,1.27; 5 2.54,-1.27; 6 2.54,1.27
2X07SMD = smd 1.016 x 3.302: 1 -1.27,-3.81; 2 -1.27,1.27; 3 1.27,-3.81; 4 1.27,1.27; 5 3.81,-3.81; 6 3.81,1.27; 7 6.35,-3.81; 8 6.35,1.27; 9 8.89,-3.81; 10 8.89,1.27; 11 11.43,-3.81; 12 11.43,1.27; 13 13.97,-3.81; 14 13.97,1.27
TDK-VLCF = smd 2.1 x 4.9: P$1 -1.7,0; P$2 1.7,0
L0805 = smd 1.3 x 1.5: 1 -0.85,0; 2 0.85,0
CHIPLED_1206 = smd 1.5 x 1.5: A 0,-1.75; C 0,1.75
LED5MMRGB = drill 0.8 pad 1.676: 1 -3.048,0; 3 1.016,0; 4 3.048,0 | drill 0.8 pad 1.676 octagon: 2 -1.016,0
CHIPLED_0805 = smd 1.2 x 1.2: A 0,-1.05; C 0,1.05
PORT_PAD_SMD_MAIN = smd 2 x 2: AVCC 0,-6.35; IR_EMIT 0,6.35; IR_SENSE 0,3.81; P_EMIT 0,1.27; P_SENS 0,-1.27; VCC 0,-3.81
R0603 = smd 1 x 1.1: 1 -0.85,0; 2 0.85,0
P-LCC-6_TOPLED = smd 4 x 4: A1 -2.65,-2.7; A2 2.65,-2.7; A3 2.65,2.7; C1 -2.65,2.7 | smd 0.6 x 4: C2 0,-2.7; C3 0,2.7
TACTILE_SWITCH_SMD = smd 1.524 x 0.762: 1 -2.54,1.905; 2 2.54,1.905; 3 -2.54,-1.905; 4 2.54,-1.905
CTS-219-02 = smd 1.13 x 2.44: 1 -1.27,-4.3; 2 1.27,-4.3; 3 1.27,4.3; 4 -1.27,4.3
SJ_2S-TRACE = smd 0.635 x 1.27: 1 -0.508,0; 2 0.508,0
SOT23-BEC = smd 1 x 1.4: B -0.95,-1.1; C 0,1.1; E 0.95,-1.1
PAD.03X.05 = smd 1.27 x 1.27: P$1 0,0
SOT23-6-INV = smd 0.55 x 1.2: 1 0.95,1.3; 2 0,1.3; 3 -0.95,1.3; 4 -0.95,-1.3; 5 0,-1.3; 6 0.95,-1.3
SOP65P640X120-8N = smd 1.473 x 0.356: 1 -2.921,0.965; 2 -2.921,0.33; 3 -2.921,-0.33; 4 -2.921,-0.965; 5 2.921,-0.965; 6 2.921,-0.33; 7 2.921,0.33; 8 2.921,0.965
MSOP12-EP = smd 0.9 x 0.42: 1 -2.05,1.6; 2 -2.05,0.95; 3 -2.05,0.3; 4 -2.05,-0.35; 5 -2.05,-1; 6 -2.05,-1.65; 7 2.05,-1.65; 8 2.05,-1; 9 2.05,-0.35; 10 2.05,0.3; 11 2.05,0.95; 12 2.05,1.6 | smd 1.651 x 2.845: 13 0,0
8-TSSOP_4.4MM = smd 1.473 x 0.356: 1 -2.921,0.965; 2 -2.921,0.33; 3 -2.921,-0.33; 4 -2.921,-0.965; 5 2.921,-0.965; 6 2.921,-0.33; 7 2.921,0.33; 8 2.921,0.965
TSSOP28 = smd 0.305 x 0.991: 1 -4.225,-2.918; 2 -3.575,-2.918; 3 -2.925,-2.918; 4 -2.275,-2.918; 5 -1.625,-2.918; 6 -0.975,-2.918; 7 -0.325,-2.918; 8 0.325,-2.918; 9 0.975,-2.918; 10 1.625,-2.918; 11 2.275,-2.918; 12 2.925,-2.918; 13 3.575,-2.918; 14 4.225,-2.918; 15 4.225,2.918; 16 3.575,2.918; 17 2.925,2.918; 18 2.275,2.918; 19 1.625,2.918; 20 0.975,2.918; 21 0.325,2.918; 22 -0.325,2.918; 23 -0.975,2.918; 24 -1.625,2.918; 25 -2.275,2.918; 26 -2.925,2.918; 27 -3.575,2.918; 28 -4.225,2.918
TQFP44 = smd 1.5 x 0.5: 1 -5.8,4; 2 -5.8,3.2; 3 -5.8,2.4; 4 -5.8,1.6; 5 -5.8,0.8; 6 -5.8,0; 7 -5.8,-0.8; 8 -5.8,-1.6; 9 -5.8,-2.4; 10 -5.8,-3.2; 11 -5.8,-4; 23 5.8,-4; 24 5.8,-3.2; 25 5.8,-2.4; 26 5.8,-1.6; 27 5.8,-0.8; 28 5.8,0; 29 5.8,0.8; 30 5.8,1.6; 31 5.8,2.4; 32 5.8,3.2; 33 5.8,4 | smd 0.5 x 1.5: 12 -4,-5.8; 13 -3.2,-5.8; 14 -2.4,-5.8; 15 -1.6,-5.8; 16 -0.8,-5.8; 17 0,-5.8; 18 0.8,-5.8; 19 1.6,-5.8; 20 2.4,-5.8; 21 3.2,-5.8; 22 4,-5.8; 34 4,5.8; 35 3.2,5.8; 36 2.4,5.8; 37 1.6,5.8; 38 0.8,5.8; 39 0,5.8; 40 -0.8,5.8; 41 -1.6,5.8; 42 -2.4,5.8; 43 -3.2,5.8; 44 -4,5.8
XBEE-SMD = smd 1.7 x 0.85: 1 -12.5,20; 2 -9.5,18; 3 -12.5,16; 4 -9.5,14; 5 -12.5,12; 6 -9.5,10; 7 -12.5,8; 8 -9.5,6; 9 -12.5,4; 10 -9.5,2; 11 12.5,2; 12 9.5,4; 13 12.5,6; 14 9.5,8; 15 12.5,10; 16 9.5,12; 17 12.5,14; 18 9.5,16; 19 12.5,18; 20 9.5,20
RESONATOR-SMD = smd 0.8 x 2.1: 1 -1.2,0; 2 0,0; 3 1.2,0

### Placement (x,y rotation side)
C1  29.1,75 90 top
C2  15,98 180 top
C3  16.25,87.5 90 top
C4  18.25,87.5 90 top
C5  11.25,83 0 top
C6  5.78,81.99 90 top
C7  20.75,85.5 90 top
C8  22.75,85.5 90 top
C9  53.75,9.75 270 top
C10  47.25,8.75 180 top
C11  52.75,89 180 top
C12  50.25,90.5 270 top
C13  68.5,30.5 270 top
C14  91.05,62.3 315 top
C15  90.9,59.3 135 top
C16  76.3,60.3 225 top
C17  74.05,46.95 315 top
C18  90.4,46.2 45 top
C19  81.25,63.5 45 top
JP1  34,53 180 top
JP2  60,18 90 top
JP3  64,69.5 0 top
JP4  102.5,75 270 top
L1  20.25,76.25 0 top
L2  24.7,85.65 90 top
LED1  106.25,84.75 0 top
LED2  110,53 90 bottom
LED3  108.5,32.5 90 top
LED4  108.5,26 90 top
LED5  108.5,19.5 90 top
LEFT  27,6 90 top
R1  8,94.5 270 top
R2  10,94.5 90 top
R3  30.35,78.1 90 top
R4  14.25,78.5 90 top
R5  13.75,82.5 270 top
R6  8.25,81 180 top
R7  11.25,81 180 top
R8  8.25,83 180 top
R9  105.25,89 0 top
R10  19.25,91.5 90 bottom
R11  25.25,77.75 0 bottom
R12  57.75,9.75 270 top
R13  55.75,9.75 90 top
R14  63,9.75 270 top
R15  61,9.75 90 top
R16  51.25,13.5 180 top
R17  68,43.5 0 top
R18  72,40.75 270 top
R19  35.4,99 270 top
R20  40,9.75 90 top
R21  48.2,88.2 90 top
R22  96.6,44.35 315 top
R23  98,45.75 315 top
R24  71.5,46.5 315 top
R25  85.25,28.25 90 top
R26  104.5,32.5 0 top
R27  104.5,26 0 top
R28  104.5,19.5 0 top
RGB_LED_L  40,21 270 bottom
RGB_LED_M  40,53 270 bottom
RGB_LED_R  40,85 270 bottom
RIGHT  27,100 270 top
S1  102.25,84.75 270 top
S2  68.25,81.25 270 top
SJ1  63,38.5 90 top
T1  69,40.75 90 top
T2  88,28.5 0 top
TP1  29.5,88.75 0 top
TP2  19.5,92.5 0 top
TP3  21.25,89.75 0 top
TP4  17,92.25 0 top
TP5  31.75,88.75 0 top
TP6  55.75,7.5 0 top
TP7  50.5,8.75 0 top
TP8  54.25,13.75 0 top
TP9  1.5,73.5 0 top
TP10  4.5,73.5 0 top
U1  26.5,75 0 top
U2  15,95.5 0 top
U3  17.25,81.5 90 top
U4  47.25,11 0 top
U5  52.5,83.25 270 top
U6  83,53 45 top
U7  76,22 270 top
Y1  77.25,44.25 315 top

### Tracks (layer width: path | path; a pad name or v marks a point on that pad's centre or on a via)
AGND  (via drill 0.3, 0.6)
  Top 0.305: C9.2 v52.75,8.9 | R12.1 v58.8,10.6 | R19.2 v35.4,97.1 | 91.45,61.75 C14.2 91.95,61.7 | 99,63.5 98.76,63.5 JP4.11
  Top 0.406: U2.4 13.46,94.53 13.5,94.55 14,95 14,97.85 C2.2 13.5,98 v13,97.5 | R2.1 10.15,93.5 v17,93.5 17.92,93.92 U2.5 U2.6 | v46.4,7.75 C10.2 46.24,8.91 46.24,9.51 45.75,10 44.36,10 U4.4 | R15.1 v59.96,8.91 | R20.1 v40,7.88
  Top 0.813: 95.5,63.5 98.76,63.5 | JP4.11 100.57,63.57 101.5,64.85 v106.15,64.85 | TP4.P$1 v17,93.5
  Bottom 0.305: 109.8,64.85 109.7,64.65
  Bottom 0.813: v106.15,64.85 109.8,64.85
  other vias: 90,61 89.5,60.5 89,59.75 89.5,59.25
  pour Bottom (isolate 0.305, no thermals): 0.5,98.5 0.5,92.25 105.78,92.25 arc-90 109.5,88.53 109.5,19.02 arc-90 104.48,14 0.5,14 0.5,7.5 112.5,7.5 arc90 116,11 116,94.47 arc90 111.97,98.5
  pour Bottom (no thermals): 82.65,62.4 79.25,59 arc90 79.25,58.5 80.35,57.4 arc90 81.15,57.4 82.47,58.72 arc-90 83.53,58.72 86.61,55.64 arc90 87.19,55.64 91.36,59.81 arc90 91.36,60.39 90.35,61.4 arc90 89.65,61.4 87.73,59.48 arc-90 86.27,59.48 83.35,62.4 arc90
  pour Top (no thermals): 88.75,60.25 89.82,61.32 arc-90 90.18,61.32 90.16,61.34 arc88 90.6,61.58 93.25,64.1 100.75,64.1 100.75,63 95.25,63 95.17,63.02 arc-45 95.15,63 94.6,63 arc45 94.18,62.93 90.32,59.07 arc-45 90.15,59 89.31,59 arc-90 88.75,59.56
AREF
  Top 0.305: U6.29 86.67,57.82
  Top 0.406: 86.67,57.82 88,59.15 88,60.5
  Top 0.61: 88,60.5 90,62.5 90.35,62.75 C14.1
AVCC  (via drill 0.6)
  Top 0.305: 48.76,11.98 49.73,11.98
  Top 0.406: C15.1 91.55,58.5 89.65,58.5 87.69,56.54 U6.27 | 20.96,94.97 21,95 | U2.8 17.89,96.5 16.5,96.5 15.85,97.15 C2.1 21,98 | R14.2 63,2 46.5,2 | U4.8 50.16,11.98 48.76,11.98 48.1,11.32 C10.1 48.1,2.15 51,2 | 49.73,11.98 50.25,12.5 50.25,13.35 R16.2
  Top 0.61: v108.5,43.5 115,43.5 | C15.1 98.7,58.7 98.75,58.75 | 98.75,58.75 98.75,60.97 JP4.13 | 98.75,58.75 v106,58.75
  Top 0.813: TP2.P$1 20.5,92.5 21,93
  Top 1.27: RIGHT.AVCC 21,100 | 21,100 21,102.5 22.5,104 106,104 115,95 115,43.5 115,11 106,2 63,2 51,2 46.5,2 35,2 33.5,3.5 33.5,5.85 LEFT.AVCC | 21,100 21,98 21,95 21,93 24.75,89.75 L2.2
  Bottom 0.61: v106,58.75 107.45,57.95 107.5,51.5 108.5,50.5 v108.5,43.5
BLUE_L  (via drill 0.3, 0.6)
  Top 0.305: v40,21 41,21.75 41,39.75 v47,45.5 | v47,53 47,63.5 54.5,71 57.5,74 57.5,78.5 56.98,79.03 U5.15
  Bottom 0.305: RGB_LED_L.C3 v40,21 | v47,45.5 v47,53
BLUE_M  (via drill 0.3)
  Top 0.305: v40,53 42.5,53 44,54.5 44,76.96 47.36,80.32 U5.12
  Bottom 0.305: RGB_LED_M.C3 v40,53
BLUE_R  (via drill 0.3)
  Top 0.305: v40,85 45.75,85 47.83,82.92 U5.8
  Bottom 0.305: RGB_LED_R.C3 v40,85
BLUE_T
  Top 0.305: LED2.4 110,56 110.5,56 111,56.5 111,86.5 104,93.5 64,93.5 62.75,92.25 62.75,87.25 58.48,82.93 55.47,82.93 U5.21
BO_A4
  Top 0.305: U6.33 84.33,59.93 85.1,60.7 85.07,62.67 96.1,73.7 98.66,73.7 JP4.3
BO_A5
  Top 0.305: U6.32 84.86,59.36 85.8,60.3 85.8,62.1 94.9,71.2 97.8,71.2 98,71 98.5,71 JP4.5
BO_A6
  Top 0.305: U6.31 86.5,59.9 86.5,61.6 93.6,68.7 98.64,68.7 JP4.7
BO_A7
  Top 0.305: U6.30 85.97,58.27 87.2,59.5 87.2,61.2 92.1,66.1 JP4.9
BO_C4
  Top 0.305: U6.23 89.97,54.27 90.2,54.5 107.5,54.5 108.5,55.5 108.5,73 107.77,73.73 JP4.4
BO_C5
  Top 0.305: U6.24 89.36,54.86 90,55.5 107.25,55.5 108,56.25 108,70.8 107.6,71.2 103.2,71.2 103,71 103.58,71 JP4.6
BO_C6
  Top 0.305: U6.25 88.85,55.4 89.95,56.5 106.75,56.5 107.5,57.25 107.5,68.2 107.1,68.6 103.82,68.6 JP4.8
BO_C7
  Top 0.305: U6.26 88.28,56.03 89.75,57.5 106.25,57.5 107,58.25 107,65.7 106.6,66.1 JP4.10
BO_LED_11
  Top 0.305: JP4.1 98.66,76.3 96.3,76.3 95,75 67,75 65.5,75 59.49,80.98 55.43,80.98 U5.18
BO_LED_12
  Top 0.305: JP4.2 102.23,76.27 101,77.5 96,77.5 94,75.5 67.5,75.5 66,75.5 59.29,82.27 55.48,82.27 U5.20
FTDI_RST1
  Top 0.305: JP2.6 68.28,29.43 C13.2
GND  (via drill 0.3, 0.6)
  Top 0.305: U6.18 87.74,49.46 | S1.1 104.16,86.75 104.15,86.75 | 78.8,29.5 78,30.3 U7.10 | R28.1 v102.4,19.5 | C16.2 75.7,59.8 | R21.2 v48.2,90.05 | T2.E 88.95,27.3 v90,27.25 | T1.E 70.1,42.6 v70.25,42.75 | U6.39
  Top 0.406: U6.39 76.7,59.3 76.1,59.3 C16.2 | 87.74,49.46 90,47.2 90.6,47.2 C18.2 91,46.5 v91.55,45.95 | U6.6 77.25,47.25 75.5,47.25 C17.2 74.65,46.4 74.6,46.4 C17.2 | 75.7,59.8 v75.05,60.45 | U6.28 v85.5,55.5 | C1.2 29.35,75.25 | C1.2 29.15,76 v30.25,76 30.25,77 R3.1 | U1.2 26.75,77 27.25,77.5 28.65,77.5 29.1,77 C1.2
  Top 0.61: 74.6,46.4 74.4,46.15 v73.75,45.5 | C19.2 v82.75,65 | TP5.P$1 v31.75,87.5 | S2.1 63.95,81.3 | S2.2 63.95,81.3 | 63.95,81.3 v63.75,81.25
  Top 1.016: JP2.1 67.13,16.73 v67.2,16.8 | JP4.12 104.43,63.57 v105.25,62.5
  Bottom 0.305: v102.4,19.5 101.6,19.5 101.5,19.4 | v91.55,45.95 91.5,45.5 | v90,27.25 90,26.75 | v70.25,42.75 70.25,43 70.5,43.25
  Bottom 0.61: v82.75,65 83,65.25
  Bottom 1.016: v67.2,16.8 67.3,16.8 | v105.25,62.5 105.5,62.25
  other vias: 103.15,88.6 74.6,32.4 74.6,24.9 79.1,24.9 79.1,32.4 74.6,27.9 79.1,27.9 74.6,29.4 74.6,26.4 79.1,26.4 76.1,24.9 77.6,24.9 74.6,30.9 79.1,30.9 79.1,29.4 76.1,32.4 104.15,84.85 54,86.5 53,86.5 52,86.5 51,86.5 51,85.5 51,84.5 51,83.5 51,82.5 51,81.5 52,85.5 53,85.5 54,85.5 54,84.5 52,84.5 53,84.5 52,83.5 53,83.5 54,83.5 52,82.5 53,82.5 54,82.5 54,81.5 53,81.5 52,81.5 51,80.5 52,80.5 53,80.5 54,80.5 54,79.5 53,79.5 52,79.5 51,79.5 75,44.25 78.3,45.3 75.75,43.5 76.5,42.75 77.25,42
  pour Bottom (isolate 0.305, rank 2, no thermals): 0.5,33 14,33 arc90 16.5,35.5 16.5,71.79 arc-90 17.21,72.5 23.7,72.5 arc90 26,74.8 26,89.48 arc-90 27.27,90.75 104.99,90.75 arc-90 108,87.74 108,19 arc-90 104.5,15.5 0.5,15.5
  pour Top (no thermals): 77,47 80,44 77.25,41.25 74.25,44.25
  pour Top: 74,33 74,24 80,24 80,33
  pour Top (no thermals): 49.25,90 49.25,78.25 56,78.25 56,87 52.81,87 arc-90 52.5,87.56 52.5,90
  pour Top: 102.5,89.75 102.5,81.25 105,81.25 105,89.75
GREEN_L  (via drill 0.3)
  Top 0.305: v48,53.5 48,63.5 55,70.5 58.25,73.75 58.25,78.9 57.52,79.68 55.46,79.68 U5.16 | v45.5,23.75 45.5,42.25 48,44.75 v48,46
  Bottom 0.305: v48,46 v48,53.5 | RGB_LED_L.C2 45,21 45.5,21.5 45.5,22 v45.5,23.75
GREEN_M  (via drill 0.3)
  Top 0.305: v45.25,53 45.25,53.25 45,54 45,76.85 47.81,79.67 49.57,79.67 U5.13
  Bottom 0.305: 43.3,53 RGB_LED_M.C2 v45.25,53
GREEN_R  (via drill 0.3)
  Top 0.305: v45.5,84 46.25,83.22 47.2,82.27 U5.9
  Bottom 0.305: RGB_LED_R.C2 44.5,85 45,85 45.5,84.5 v45.5,84
GREEN_T
  Top 0.305: LED2.3 110,54 111,54 111.5,54.5 111.5,87 104.5,94 63.25,94 62,92.75 62,87.6 58,83.57 55.44,83.57 U5.22
I2C_SCL  (via drill 0.3)
  Top 0.305: U6.19 88.27,49.98 90.25,48 93.1,48 v95,46 R22.1 | v101,45.5 110.5,45.5 113,48 113,88 105.5,95.5 62.5,95.5 60.5,93.5 60.5,89.55 57.15,86.18 55.44,86.18 U5.26
  Bottom 0.305: v101,45.5 95.5,45.5 v95,46
I2C_SDA
  Top 0.305: U6.20 90.4,49 94.75,49 R23.1 97.55,46.5 98.75,46.5 100.75,44.5 110.5,44.5 113.5,47.5 113.5,88.5 106,96 61.75,96 59.75,94 59.75,89.8 56.81,86.82 55.57,86.82 U5.27
  Top 0.406: U6.20
IR_EMIT_L  (via drill 0.3)
  Top 0.305: LEFT.IR_EMIT 20.62,4.18 21.5,3.5 v32,3.5 | v49,53 49,63.5 55.5,70 59,73.5 59,79.5 58.17,80.33 U5.17 | v35.5,3.5 35.5,12.25 42.5,19.25 49,25.75 v49,45.5
  Bottom 0.305: v49,45.5 v49,53 | v32,3.5 v35.5,3.5
IR_EMIT_R  (via drill 0.3)
  Top 0.305: v43.25,92.5 35.75,92.5 33.5,94.75 33.5,99.5 33.35,99.65 RIGHT.IR_EMIT | U5.6 48.52,84.22 47,85.75 v47,90.5
  Bottom 0.305: v43.25,92.5 43.75,92 46,92 v47,90.5
IR_SENSE_L  (via drill 0.3)
  Top 0.305: v61.5,44.5 60.5,44.5 57.5,41.5 57.5,32.5 v40,15 R20.2 | v64.25,44.5 65.5,44.5 67,46 67,48 v69.5,50.5 | U6.37 80.01,58.25 79.1,59.15 79,59.25 79,60.5 77,62.5 76,62.5 74.25,61 74.25,59 72,57 v72,55 | v25.25,15 23.25,12.75 23.25,6.06 LEFT.IR_SENSE
  Bottom 0.305: v61.5,44.5 v64.25,44.5 | v69.5,50.5 72,53 v72,55 | v25.25,15 v40,15
IR_SENSE_R  (via drill 0.3)
  Top 0.305: RIGHT.IR_SENSE 30.81,100.81 32,102 34.5,102 35.4,101.4 R19.1 35.4,99.9 35.5,100 52.75,100 v59,92.5 | v64.75,92.5 64.75,88.75 70,83.5 v70,76.3 | v70,71.5 80.5,61 80.5,60.02 U6.35
  Bottom 0.305: v59,92.5 v64.75,92.5 | v70,76.3 v70,71.5
MISO
  Top 0.305: U6.2 76.56,51.16 75.6,50.2 73.8,50.2 70,54 70,59.5 67.5,62 63.5,62 61.46,64.04 JP3.1
MOSI
  Top 0.305: U6.1 76.03,51.73 75.4,51.1 74.4,51.1 71,54.5 71,60 69,62 69,71.5 68,72.5 65,72.5 64,71.5 JP3.4
N$1
  Top 0.305: R27.2 LED4.C
N$2  (via drill 0.3)
  Top 0.305: 25.75,6.75 LEFT.P_EMIT 25.75,6.02 25.75,12.75 v27,14.25 | v41,14.25 58.5,31.75 58.5,40.75 61.25,43.5 v61.75,43.5 | v64.5,43.5 R17.1
  Bottom 0.305: v27,14.25 v41,14.25 | v61.75,43.5 v64.5,43.5
N$4
  Top 0.813: C6.1 7.26,81.14 R6.2
N$5
  Top 0.305: T2.B R25.1
N$6
  Top 0.406: 14.35,79.45 R4.2
  pour Top (no thermals): 13.7,79.9 13.7,78.85 15.75,78.85 15.9,79 15.9,79.9
N$7
  Top 0.813: JP2.3 64.29,21.81 63,23.1 SJ1.1
N$8
  Top 0.305: R26.2 LED3.C
N$9
  Top 0.305: U4.6 51.67,10.67 53,12 59.6,12 R15.2 R14.1
N$10
  Top 0.305: T2.C U7.5
N$11
  Top 0.406: U2.3 12.06,95.15 10.85,95.15 10.65,95.35 R2.2 R1.1
N$12
  Top 0.305: R9.2 106.1,86.65 LED1.C
N$13
  Top 0.305: R28.2 LED5.C
N$14
  Top 0.305: T1.B 71.9,39.8 R18.2
N$15
  pour Top (no thermals): 17.8,79.9 17.4,79.9 17.4,78.15 17.5,78 17.5,73.8 19.6,73.8 19.6,78.75 17.98,78.75 17.8,78.95
N$16
  pour Top (no thermals): 18.7,79 18.7,79.9 22,79.9 22.97,78.67 23.01,73.78 20.9,73.78 20.91,78.72 20.5,79
N$18  (via drill 0.3, 0.6)
  Top 0.305: S1.4 100.34,90.16 99.5,91 v66.5,91 | v57,91.75 55.5,93.25 45,93.25 43.75,91.5 v28,91.5 | U1.1 27.49,75.96 27.49,75.49 27,75 25.25,75 24.75,75.5 24.75,79 v25.25,79.5
  Top 0.406: S1.3 S1.4
  Bottom 0.305: v66.5,91 57.75,91 v57,91.75 | v25.25,79.5 25.25,90.75 26,91.5 v28,91.5
N$19
  pour Top (isolate 0.254, no thermals): 13.25,83.8 13.25,82.9 14.37,82.91 15.34,83.14 15.81,83.15 15.81,83.95 15.4,83.96 14.38,83.81
N$20
  Top 0.305: T1.C 67.9,41.9 68.75,42.75 68.75,43.4 R17.2
N$21
  Top 0.406: U3.11 16.3,84.1 16.05,84.35 9.85,84.35
  pour Top (no thermals): 11,84.5 11,80.25 8.5,80.25 8.5,83.94 9.06,84.5
N$22
  Top 0.406: R5.2 13.73,81.65
  Top 0.813: C5.2 12.25,83 13.25,82 13.4,82 R5.2
NETWORK_LED  (via drill 0.3)
  Top 0.305: U6.22 90.02,51.73 91.25,50.5 98,50.5 100.25,48.25 v110.5,48.25 | v110.5,41.25 110.5,36.25 111.75,35 111.75,21.7 LED5.A
  Bottom 0.305: v110.5,48.25 v110.5,41.25
PGND  (via drill 0.3, 0.6)
  Top 0.305: U3.2 v16.31,78.62
  Top 0.406: U3.5 18.25,81
  Top 0.61: TP3.P$1 v21.25,88.5
  Top 1.27: TP9.P$1 1.5,70 JP1.GND@6
  other vias: 18.25,89.5 17.25,89.5 14.75,88.5 14.25,89.5 16.25,89.5 20.25,88.5 22.25,87.5 23.25,87.5 22.25,88.5 23.25,88.5 13.75,88.5 13.25,89.5 19.05,82.25 19.05,81.5 19.05,80.75 15.45,80.75 15.45,81.5 15.45,82.25 19.7,82.25 19.7,81.5 19.7,80.75 14.8,82.25 14.8,81.5 14.8,80.75 15.25,89.5
  pour Bottom (isolate 0.305, rank 2, no thermals): 0.5,90.75 23.04,90.75 arc-90 24.5,89.29 24.5,75.6 arc-90 22.9,74 16.41,74 arc90 15,72.59 15,36.3 arc-90 13.2,34.5 0.5,34.5
  pour Top (no thermals): 14.5,80.5 20,80.5 20,82.5 14.5,82.5
  pour Top (no thermals): 12.75,90 12.75,87.7 18.75,87.7 18.75,90
  pour Top (no thermals): 19.75,89 19.75,86 23.75,86 23.75,89
  pour Top (no thermals): 11.58,81.54 11.63,78.34 arc21 11.72,77.9 arc45 13.1,77 16.68,77 arc90 17.16,77.48 17.15,80.5 16.75,80.5 16.75,78.62 arc-90 16.17,78.11 13.24,78.11 arc-36 12.84,78.3 arc-54 12.6,78.77 12.6,81.55
PROX_EMIT  (via drill 0.3)
  Top 0.305: U6.41 77.73,55.97 75.7,58 74,58 73,57 v73,54 | R18.1 72,43 69.5,45.25 69.5,49 v70.2,49.7
  Bottom 0.305: v73,54 73,52.5 v70.2,49.7
PROX_SENSE  (via drill 0.3)
  Top 0.305: U4.7 51.08,11.33 52,12.25 52,13.4 R16.1 52.25,13.5 53.5,14.75 54.25,14.75 | 54.25,14.75 v80,14.75 | v82,14.75 83.75,16.5 83.75,32.25 85,33.5 85,37 87.25,39.25 87.25,46.5 86.22,47.53 U6.15 | TP8.P$1 54.25,14.75
  Bottom 0.305: v80,14.75 v82,14.75
PROX_SENSE_A  (via drill 0.3)
  Top 0.305: R12.2 R13.1 TP6.P$1 55.75,5.25 54.75,4.25 v49.5,4.25 | LEFT.P_SENS 28.27,4.73 v28.75,4.25
  Bottom 0.305: v28.75,4.25 v49.5,4.25
PROX_SENSE_S
  Top 0.305: R13.2 C9.1 53.19,10.04 U4.5 50.5,9.71 TP7.P$1
PWR_CLEAR  (via drill 0.3)
  Top 0.305: v69,59 67,61 62,61 60.5,59.5 60.5,57.5 53,50 34,50 31.25,52.75 31.25,78.25 R3.2 30.35,78.65 30.34,79.02 29.75,79 27,79 25.75,77.75 25.75,76.35 U1.3 | v75.25,55.75 75.72,55.75 U6.43
  Bottom 0.305: v69,59 72,55.75 74.3,55.75 v75.25,55.75
PWR_ENABLE  (via drill 0.3)
  Top 0.305: U3.10 16.95,84.35 16.3,85 8,85 v7.25,84.25 | v7.25,79.75 7.25,78 14.25,72.5 26,72.5 26.5,73 U1.5
  Bottom 0.305: v7.25,84.25 v7.25,79.75
RED_L  (via drill 0.3)
  Top 0.305: v39.96,24.41 39.97,40.48 v46,46 | v46,53.5 46,63.5 46,76.75 48.23,79.02 49.54,79.02 U5.14
  Bottom 0.305: RGB_LED_L.C1 37.3,24.4 v39.96,24.41 | v46,46 v46,53.5
RED_M  (via drill 0.3)
  Top 0.305: v39.9,56.45 41,56.5 43,58.5 43,77.29 46.69,80.98 U5.11
  Bottom 0.305: RGB_LED_M.C1 38.45,55.65 v39.9,56.45
RED_R  (via drill 0.3)
  Top 0.305: U5.7 48.17,83.58 44.25,87.5 v39.9,87.5
  Bottom 0.305: RGB_LED_R.C1 38.5,87.5 v39.9,87.5
RED_T
  Top 0.305: LED2.1 110,50 111,50 112,51 112,87.5 105,94.5 62.75,94.5 61.25,93 61.25,87.95 57.57,84.23 55.46,84.23 U5.23
REXT
  Top 0.305: U5.1 48.33,87.47 R21.1
RST  (via drill 0.3)
  Top 0.305: U6.4 76.6,48.85 72.65,48.85 | 72.65,48.85 R24.1 70.85,47.1 70.5,46.75 70.5,45.75 75,41.25 75,39 68.5,32.5 C13.1 | 72.65,48.85 72.4,49.1 67,54.5 v67,59.5 | v67,64 67,67.77 JP3.5 | v68,76.3 68,83.5 66,85.5 v64.75,85.5 | U5.25 57.73,85.53 v57.75,85.5
  Bottom 0.305: v67,59.5 v67,64 | JP3.5 66.73,68.23 68,69.5 v68,76.3 | v64.75,85.5 v57.75,85.5
RXD
  Top 0.305: U6.9 79.8,46.4 79.8,42.6 70,32.8 70,26.2 68.2,24.4 65.13,24.4 JP2.4
SCK  (via drill 0.3)
  Top 0.305: U6.3 76,49.4 73.4,49.4 67.9,54.9 v67.9,58.3 | v67.9,62.9 65.6,62.9 64,64.5 JP3.3
  Bottom 0.305: v67.9,58.3 v67.9,62.9
TXD  (via drill 0.3)
  Top 0.305: U6.10 81.14,46.64 80.5,46 80.5,42.3 70.9,32.7 v70.9,26.9 | v69.1,26.9 JP2.5
  Top 0.406: JP2.5
  Bottom 0.305: v70.9,26.9 v69.1,26.9
VBATT  (via drill 0.3)
  Top 0.406: U3.8 18.25,83.7 | R1.2 7.95,93.75 8,94 v8,91.5 | v8,89.5 8,86 | 16.2,86 C3.1 | C4.1 18.25,85 | 13,65 13.5,65 | U1.6 27.45,73.8 27.75,73.75 28.91,73.75 C1.1 29,73.5 29,48
  Top 0.813: SJ1.2 63,47
  Top 1.016: 63,47 JP1.PWR@1
  Top 1.27: TP10.P$1 9.25,73.5 10,71.25
  Top 2.54: JP1.PWR@1 64,50 JP1.PWR@2 | JP1.PWR@2 64,57 | 64,57 JP1.PWR@3 | JP1.PWR@3 JP1.PWR@1 | JP1.PWR@1 59,48 | 56,48 55,48 | 55,48 29,48 23.5,48 13.5,57 13.5,65 10,68.5 10,71.25 10,73 1.65,79.5 1.65,85 | JP1.PWR@2 56,48 | 56,48 59,48 | 59,48 61.5,50.5 61.5,50 63,48.5 | 64,58.5 JP1.PWR@3 | 64,57 55,48
  Bottom 0.406: v8,91.5 v8,89.5
  pour Top (no thermals): 18.5,83.1 18.5,84.25 18.9,84.75 18.9,87.3 1.35,87.3 arc90 0.43,86.46 0.43,84.51 2.85,84.5 2.85,84.7 arc-90 3.5,85.5 17.4,85.5 17.4,83.1
VBATT_SENSE  (via drill 0.3)
  Top 0.305: v38.25,98.5 52.5,98.5 v58.25,91.75 | v63.6,91.75 63.6,88.9 69,83.5 v69,76.65 | v70,70 70.5,70 79.8,60.7 79.8,59.59 U6.36
  Top 0.406: U2.2 U2.1 11,97 v11,98.5
  Bottom 0.305: v58.25,91.75 v63.6,91.75 | v69,76.65 69,71 v70,70
  Bottom 0.406: v11,98.5 v38.25,98.5
VCC  (via drill 0.3, 0.6)
  Top 0.305: 97.1,43.9
  Top 0.406: U6.17 | U6.17 89.4,46.6 89.4,46 C18.1 | C16.1 77.2,60.6 77.2,59.9 79.43,57.67 U6.38 | LED4.A LED3.A 109.55,33.45 108.5,34.5 U7.1 89.8,40.7 C18.1 | 108,51.98 v108.55,51.98 | 91.02,51.98 90.5,52.5 | R24.2 73.6,47.4 C17.1 74,48.1 76.9,48.1 78.23,49.43 78.33,49.43 U6.5 | LED1.A 106.25,75.5 105.5,75 96.2,75 82.7,61.5 82.7,61.2 82.5,61 | U3.7 18.9,83.65 19.25,84 19.25,90 18.75,90.5 6,90.5 v3.75,88 | v3.75,84.75 3.75,83.5 4.55,82.7 5.64,82.7 C6.2 | 97.1,43.9 R22.2 97,43.75 | C18.1 89.9,45.6 91.75,43.75 97,43.75 | 97,43.75 R22.2 R23.2
  Top 0.61: v108.55,51.98 91.02,51.98 | JP4.14 104.27,61.02 v106,60 | v108.55,51.98 104.62,51.98 | v108.55,51.98 LED2.2 | C19.1 80.65,62.85 81.5,62 | TP1.P$1 26.75,88.75
  Top 0.813: C6.2 7.31,82.84 R8.2
  Top 1.27: LEFT.VCC 31,6.5 31,23.75 v34.25,26.75 v34.25,45.75 | 55.35,90.95 54.3,92 46,92 44.5,89.75 39.75,89.75 34.25,84.25 v34.25,83 | 82.5,61 81.5,62 69.9,73.65 62.55,73.65 61.46,72.46 JP3.2 59.27,70.77 58,69.5 58,57 52.5,51.5 34.75,51.5 32.5,53.75 32.5,79 31,81 24.75,81 23.75,82 | v34.25,58.65 v34.25,83 | v34.25,83 24.75,83 | RIGHT.VCC 23.19,94.06 26.75,91 26.75,88.75 26.75,85.25 24.5,84.5 24.75,84.5 24.75,83.5
  Bottom 0.406: v3.75,88 v3.75,84.75
  Bottom 0.61: v106,60 108.5,58.75 108.55,58.7 v108.55,51.98
  Bottom 1.016: RGB_LED_M.A3 RGB_LED_M.A2 37.55,50.35 37.2,49.75 | RGB_LED_R.A2 RGB_LED_R.A3 37.3,81.2 | RGB_LED_L.A3 36.75,19.25 | RGB_LED_R.A1 42.7,87.6 42.5,88.3
  Bottom 1.27: 37.2,49.75 34.25,49.75 | 36.75,19.25 34.25,19.25 v34.25,26.75 | RGB_LED_L.A3 RGB_LED_L.A2 | RGB_LED_L.A1 42.7,25.85 42,26.75 v34.25,26.75 | RGB_LED_M.A1 42.7,57.4 41.45,58.65 v34.25,58.65 34.25,49.75 | v34.25,45.75 34.25,49.75 | v34.25,26.75 34.25,23.1 | 42.5,88.3 42.5,89.25 41.5,90.75 35,90.75 34.25,90 v34.25,83 | v34.25,83 35,82.25 37.2,82.25 RGB_LED_R.A3 | 34.35,83.1 v34.25,83
  pour Top: 74.5,53.5 83,62 92,53 83,44 74,53
  pour Top (no thermals): 18.75,83 18.8,84 19.25,84.5 19.25,85 19.26,85.01 arc-45 20.3,85.4 25.14,85.4 arc-90 25.75,84.79 25.75,82.21 arc-90 25.04,81.5 21.46,81.5 arc-45 21.1,81.65 20.5,83
  pour Top (no thermals): 49.25,90.78 arc90 49.38,90.65 52.71,90.65 arc-90 53,90.36 53,87.96 arc90 53.71,87.25 56,87.25 56,91.1 55.65,91.5 55,92 48.5,92 48.5,91.45 48.58,91.45 arc-90
XBEE_CTS
  Top 0.305: U6.14 86.5,46.1 86.5,39.75 81.25,34.5 81.25,33 81,32.75 81,13.5 U7.12
XBEE_NET_0  (via drill 0.3)
  Top 0.305: U6.44 75.48,54.27 74.5,55.25 v74.5,56.5 | v70.75,76.75 70.75,81.5 71.75,82.5 72.28,82.5 S2.4 | v72.5,58.5 72.5,60 70.75,61.75 v70.75,68.75
  Bottom 0.305: v74.5,56.5 v72.5,58.5 | v70.75,68.75 v70.75,76.75
XBEE_NET_1  (via drill 0.3)
  Top 0.305: U6.42 76.85,55.4 v75.25,57 | v73.25,59 73.25,60.25 71.5,62 v71.5,68 | v71.5,76.25 71.5,79.18 S2.3
  Bottom 0.305: v75.25,57 v73.25,59 | v71.5,68 v71.5,76.25
XBEE_RST
  Top 0.305: U6.16 86.54,48.36 88,46.9 88,38.75 86,36.75 86,33.5 85,32.5 85,29.25 R25.2
XBEE_RTS  (via drill 0.3)
  Top 0.305: 89.36,51.14 U6.21 89.75,50.77 89.75,50.75 90.75,49.75 97.5,49.75 100,47.25 v109.75,47.25 | v109.75,42.25 109.75,35.75 111,34.5 111,24.25 109.5,22.75 95.25,22.75 88,15.5 U7.16
  Bottom 0.305: v109.75,42.25 v109.75,47.25
XBEE_RXD  (via drill 0.6)
  Top 0.305: R27.1 97.5,26 94,30 U7.2 92.5,31.5 90.5,33.5 90.5,36 v88.75,37.75 | U6.11 82,44.5 v85,41.5
  Bottom 0.305: v85,41.5 v88.75,37.75
XBEE_TXD  (via drill 0.6)
  Top 0.305: U6.12 84.25,43.7 v85,43 | R26.1 95.3,32.5 93.5,34.5 U7.3 92,36 v88.75,39.25
  Bottom 0.305: v85,43 v88.75,39.25
XBEE_WAKE
  Top 0.305: U6.13 84.86,46.64 85.5,46 85.75,45.75 85.75,40.25 85.5,40 U7.9
Y1_1
  Top 0.305: Y1.1 76.25,45.3 76.1,46.1 76.5,46.5 77.6,46.5 79.43,48.33 U6.7
Y1_2
  Top 0.305: U6.8 79.28,47.03 79.29,47.04 arc45 79.2,46.82 79.2,44.75 78.7,44.25 78.2,43.75 Y1.3 78,43.25
(copper drawn outside any net)
  shapes: Bottom area x4, Top area x2

### Text on the board
tPlace: 0: / 1: / 2: / 3: | Coordinator
tNames: PWM via TLC | 11 | 12 | A4 | 20 | ANALOG | DIGITAL | A5 | 21 | A6 | 22 | A7 | 23 | AGND | GND | AVCC | VCC
tValues: NORMELLY IT WERKS! | IRIDIA | TAM | (Series 1) | XB24-DMWIT-250 | XBEE | created by / Arne Brutschy / / ver 5 rev D / 16/09/2013 | GND
tDocu: G